# EAGLE design EMGrealPart6-doc (EAGLE 9.4.0)

## Sheet 1 of 6
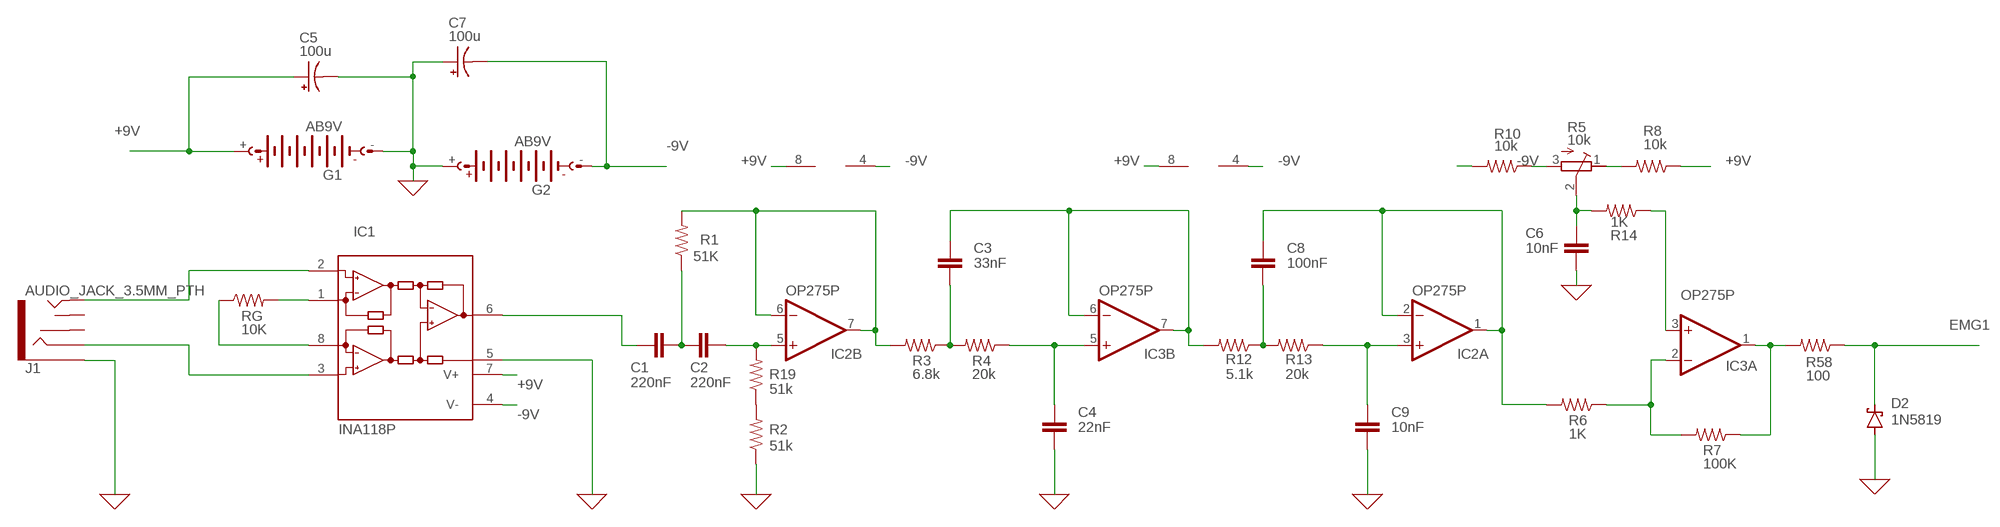
[diagram p0: schematic, sheet 1]

### Parts
C1  220nF  C-EU050-025X075  [C050-025X075]
C2  220nF  C-EU050-025X075  [C050-025X075]
C3  33nF  C-EU050-025X075  [C050-025X075]
C4  22nF  C-EU050-025X075  [C050-025X075]
C5  100u  CPOL-USE2.5-6  [E2,5-6]
C6  10nF  C-EU050-025X075  [C050-025X075]
C7  100u  CPOL-USE2.5-6  [E2,5-6]
C8  100nF  C-EU050-025X075  [C050-025X075]
C9  10nF  C-EU050-025X075  [C050-025X075]
D2  1N5819  SCHOTTKY-DIODEF126Z12  [F126Z12]
G1  AB9V  [AB9V]
G2  AB9V  [AB9V]
IC1  INA118P  [DIL08]
IC2  OP275P  [DIL08]
IC3  OP275P  [DIL08]
J1  AUDIO_JACK_3.5MM_PTH  [AUDIO-JACK]
R1  51K  R-US_0207/12  [0207/12]
R2  51k  R-US_0207/12  [0207/12]
R3  6.8k  R-US_0207/12  [0207/12]
R4  20k  R-US_0207/12  [0207/12]
R5  10k  R-TRIMMT93YA  [RTRIMT93YA]
R6  1K  R-US_0207/12  [0207/12]
R7  100K  R-US_0207/12  [0207/12]
R8  10k  R-US_0207/12  [0207/12]
R10  10k  R-US_0207/12  [0207/12]
R12  5.1k  R-US_0207/12  [0207/12]
R13  20k  R-US_0207/12  [0207/12]
R14  1K  R-US_0207/12  [0207/12]
R19  51k  R-US_0207/12  [0207/12]
R58  100  R-US_0207/12  [0207/12]
RG  10K  R-US_0207/12  [0207/12]

### Nets
0 [supply]: C4.2 C6.2 C9.2 D2.A IC1.5(REF) J1.SLEEVE R2.1 ; supply symbol labelled GND ; also sheet 2,3,4,5
+9V [supply]: C5.+ G1.+ IC1.7(V+) IC2.8(P:V+) IC3.8(P:V+) R8.1 ; also sheet 2,3,4
-9V [supply]: C7.- G2.- IC1.4(V-) IC2.4(P:V-) IC3.4(P:V-) R10.2 ; also sheet 2,3,4
EMG1 [signal]: D2.C R58.1 ; also sheet 5
N$1 [signal]: IC1.1(RG) RG.2
N$2 [signal]: IC1.8(RG) RG.1
N$3 [signal]: IC1.2(-IN) J1.TIP
N$4 [signal]: C8.2 R12.1 R13.2
N$5 [signal]: C1.2 C2.1 R1.1
N$6 [signal]: C1.1 IC1.6(OUT)
N$7 [signal]: C2.2 IC2.5(B:+IN) R19.2
N$8 [signal]: IC2.6(B:-IN) IC2.7(B:OUT) R1.2 R3.2
N$9 [signal]: C3.2 R3.1 R4.2
N$10 [signal]: C4.1 IC3.5(B:+IN) R4.1
N$11 [signal]: C3.1 IC3.6(B:-IN) IC3.7(B:OUT) R12.2
N$14 [signal]: C9.1 IC2.3(A:+IN) R13.1
N$15 [signal]: R5.3(A) R10.1
N$16 [signal]: C6.1 R5.2(S) R14.2
N$17 [signal]: IC3.2(A:-IN) R6.1 R7.2
N$18 [signal]: R2.2 R19.1
N$19 [signal]: C8.1 IC2.1(A:OUT) IC2.2(A:-IN) R6.2
N$20 [signal]: R5.1(E) R8.2
N$25 [signal]: IC3.3(A:+IN) R14.1
N$26 [signal]: IC1.3(+IN) J1.RING
N$107: IC3.1(A:OUT) R7.1 R58.2
N$143 [supply]: C5.- C7.+ G1.- G2.+ ; supply symbol labelled GND
Unconnected: J1.RSH J1.TSH

## Sheet 2 of 6
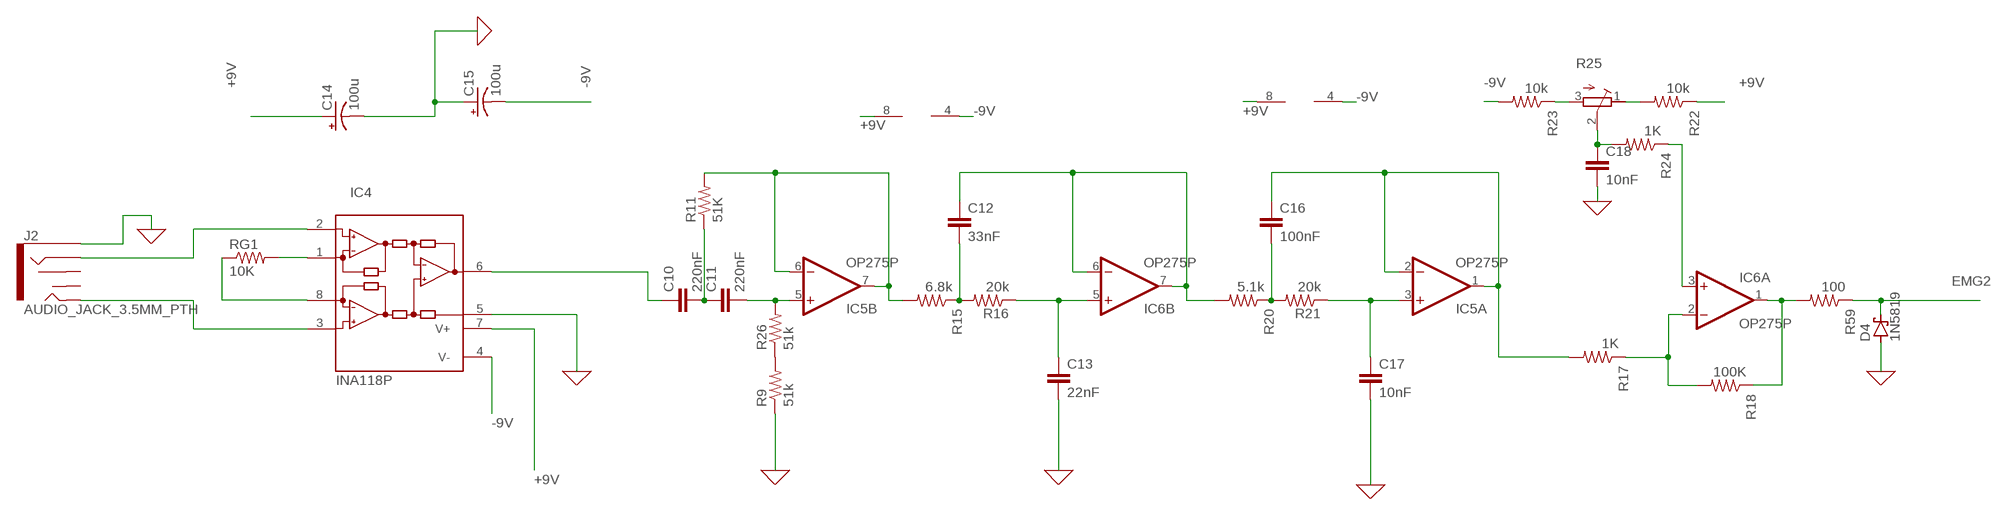
[diagram p1: schematic, sheet 2]

### Parts
C10  220nF  C-EU050-025X075  [C050-025X075]
C11  220nF  C-EU050-025X075  [C050-025X075]
C12  33nF  C-EU050-025X075  [C050-025X075]
C13  22nF  C-EU050-025X075  [C050-025X075]
C14  100u  CPOL-USE2.5-6  [E2,5-6]
C15  100u  CPOL-USE2.5-6  [E2,5-6]
C16  100nF  C-EU050-025X075  [C050-025X075]
C17  10nF  C-EU050-025X075  [C050-025X075]
C18  10nF  C-EU050-025X075  [C050-025X075]
D4  1N5819  SCHOTTKY-DIODEF126Z12  [F126Z12]
IC4  INA118P  [DIL08]
IC5  OP275P  [DIL08]
IC6  OP275P  [DIL08]
J2  AUDIO_JACK_3.5MM_PTH  [AUDIO-JACK]
R9  51k  R-US_0207/12  [0207/12]
R11  51K  R-US_0207/12  [0207/12]
R15  6.8k  R-US_0207/12  [0207/12]
R16  20k  R-US_0207/12  [0207/12]
R17  1K  R-US_0207/12  [0207/12]
R18  100K  R-US_0207/12  [0207/12]
R20  5.1k  R-US_0207/12  [0207/12]
R21  20k  R-US_0207/12  [0207/12]
R22  10k  R-US_0207/12  [0207/12]
R23  10k  R-US_0207/12  [0207/12]
R24  1K  R-US_0207/12  [0207/12]
R25  R-TRIMMT93YA  [RTRIMT93YA]
R26  51k  R-US_0207/12  [0207/12]
R59  100  R-US_0207/12  [0207/12]
RG1  10K  R-US_0207/12  [0207/12]

### Nets
0 [supply]: C13.2 C14.- C15.+ C17.2 C18.2 D4.A IC4.5(REF) J2.SLEEVE R9.1 ; supply symbol labelled GND ; also sheet 1,3,4,5
+9V [supply]: C14.+ IC4.7(V+) IC5.8(P:V+) IC6.8(P:V+) R22.1 ; also sheet 1,3,4
-9V [supply]: C15.- IC4.4(V-) IC5.4(P:V-) IC6.4(P:V-) R23.2 ; also sheet 1,3,4
EMG2 [signal]: D4.C R59.1 ; also sheet 5
N$21 [signal]: IC4.1(RG) RG1.2
N$22 [signal]: IC4.8(RG) RG1.1
N$23 [signal]: C10.1 IC4.6(OUT)
N$24 [signal]: C10.2 C11.1 R11.1
N$27 [signal]: C11.2 IC5.5(B:+IN) R26.2
N$28 [signal]: IC5.6(B:-IN) IC5.7(B:OUT) R11.2 R15.2
N$29 [signal]: C12.2 R15.1 R16.2
N$30 [signal]: C13.1 IC6.5(B:+IN) R16.1
N$31 [signal]: C12.1 IC6.6(B:-IN) IC6.7(B:OUT) R20.2
N$32 [signal]: IC6.2(A:-IN) R17.1 R18.2
N$33: IC6.1(A:OUT) R18.1 R59.2
N$34 [signal]: C16.2 R20.1 R21.2
N$35 [signal]: C17.1 IC5.3(A:+IN) R21.1
N$36 [signal]: IC4.2(-IN) J2.RING
N$37 [signal]: C16.1 IC5.1(A:OUT) IC5.2(A:-IN) R17.2
N$38 [signal]: IC4.3(+IN) J2.TIP
N$39 [signal]: R23.1 R25.3(A)
N$40 [signal]: R22.2 R25.1(E)
N$41 [signal]: IC6.3(A:+IN) R24.1
N$42 [signal]: C18.1 R24.2 R25.2(S)
N$43 [signal]: R9.2 R26.1
Unconnected: J2.RSH J2.TSH

## Sheet 3 of 6
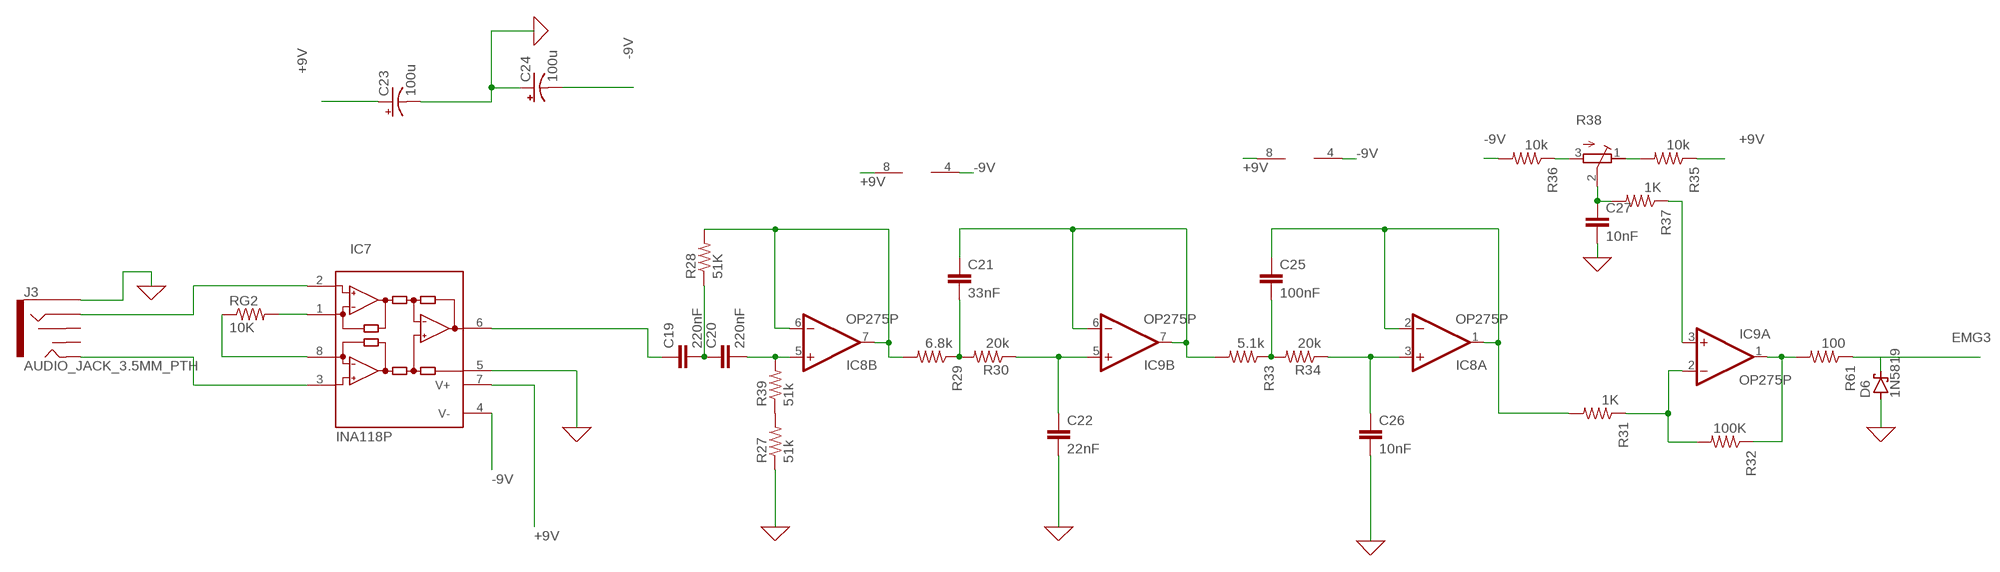
[diagram p2: schematic, sheet 3]

### Parts
C19  220nF  C-EU050-025X075  [C050-025X075]
C20  220nF  C-EU050-025X075  [C050-025X075]
C21  33nF  C-EU050-025X075  [C050-025X075]
C22  22nF  C-EU050-025X075  [C050-025X075]
C23  100u  CPOL-USE2.5-6  [E2,5-6]
C24  100u  CPOL-USE2.5-6  [E2,5-6]
C25  100nF  C-EU050-025X075  [C050-025X075]
C26  10nF  C-EU050-025X075  [C050-025X075]
C27  10nF  C-EU050-025X075  [C050-025X075]
D6  1N5819  SCHOTTKY-DIODEF126Z12  [F126Z12]
IC7  INA118P  [DIL08]
IC8  OP275P  [DIL08]
IC9  OP275P  [DIL08]
J3  AUDIO_JACK_3.5MM_PTH  [AUDIO-JACK]
R27  51k  R-US_0207/12  [0207/12]
R28  51K  R-US_0207/12  [0207/12]
R29  6.8k  R-US_0207/12  [0207/12]
R30  20k  R-US_0207/12  [0207/12]
R31  1K  R-US_0207/12  [0207/12]
R32  100K  R-US_0207/12  [0207/12]
R33  5.1k  R-US_0207/12  [0207/12]
R34  20k  R-US_0207/12  [0207/12]
R35  10k  R-US_0207/12  [0207/12]
R36  10k  R-US_0207/12  [0207/12]
R37  1K  R-US_0207/12  [0207/12]
R38  R-TRIMMT93YA  [RTRIMT93YA]
R39  51k  R-US_0207/12  [0207/12]
R61  100  R-US_0207/12  [0207/12]
RG2  10K  R-US_0207/12  [0207/12]

### Nets
0 [supply]: C22.2 C23.- C24.+ C26.2 C27.2 D6.A IC7.5(REF) J3.SLEEVE R27.1 ; supply symbol labelled GND ; also sheet 1,2,4,5
+9V [supply]: C23.+ IC7.7(V+) IC8.8(P:V+) IC9.8(P:V+) R35.1 ; also sheet 1,2,4
-9V [supply]: C24.- IC7.4(V-) IC8.4(P:V-) IC9.4(P:V-) R36.2 ; also sheet 1,2,4
EMG3 [signal]: D6.C R61.1 ; also sheet 5
N$44 [signal]: IC7.1(RG) RG2.2
N$45 [signal]: IC7.8(RG) RG2.1
N$46 [signal]: C19.1 IC7.6(OUT)
N$47 [signal]: C19.2 C20.1 R28.1
N$48 [signal]: C20.2 IC8.5(B:+IN) R39.2
N$49 [signal]: IC8.6(B:-IN) IC8.7(B:OUT) R28.2 R29.2
N$50 [signal]: C21.2 R29.1 R30.2
N$51 [signal]: C22.1 IC9.5(B:+IN) R30.1
N$52 [signal]: C21.1 IC9.6(B:-IN) IC9.7(B:OUT) R33.2
N$53 [signal]: IC9.2(A:-IN) R31.1 R32.2
N$54: IC9.1(A:OUT) R32.1 R61.2
N$55 [signal]: C25.2 R33.1 R34.2
N$56 [signal]: C26.1 IC8.3(A:+IN) R34.1
N$57 [signal]: IC7.2(-IN) J3.RING
N$58 [signal]: C25.1 IC8.1(A:OUT) IC8.2(A:-IN) R31.2
N$59 [signal]: IC7.3(+IN) J3.TIP
N$60 [signal]: R36.1 R38.3(A)
N$61 [signal]: R35.2 R38.1(E)
N$62 [signal]: IC9.3(A:+IN) R37.1
N$63 [signal]: C27.1 R37.2 R38.2(S)
N$64 [signal]: R27.2 R39.1
Unconnected: J3.RSH J3.TSH

## Sheet 4 of 6
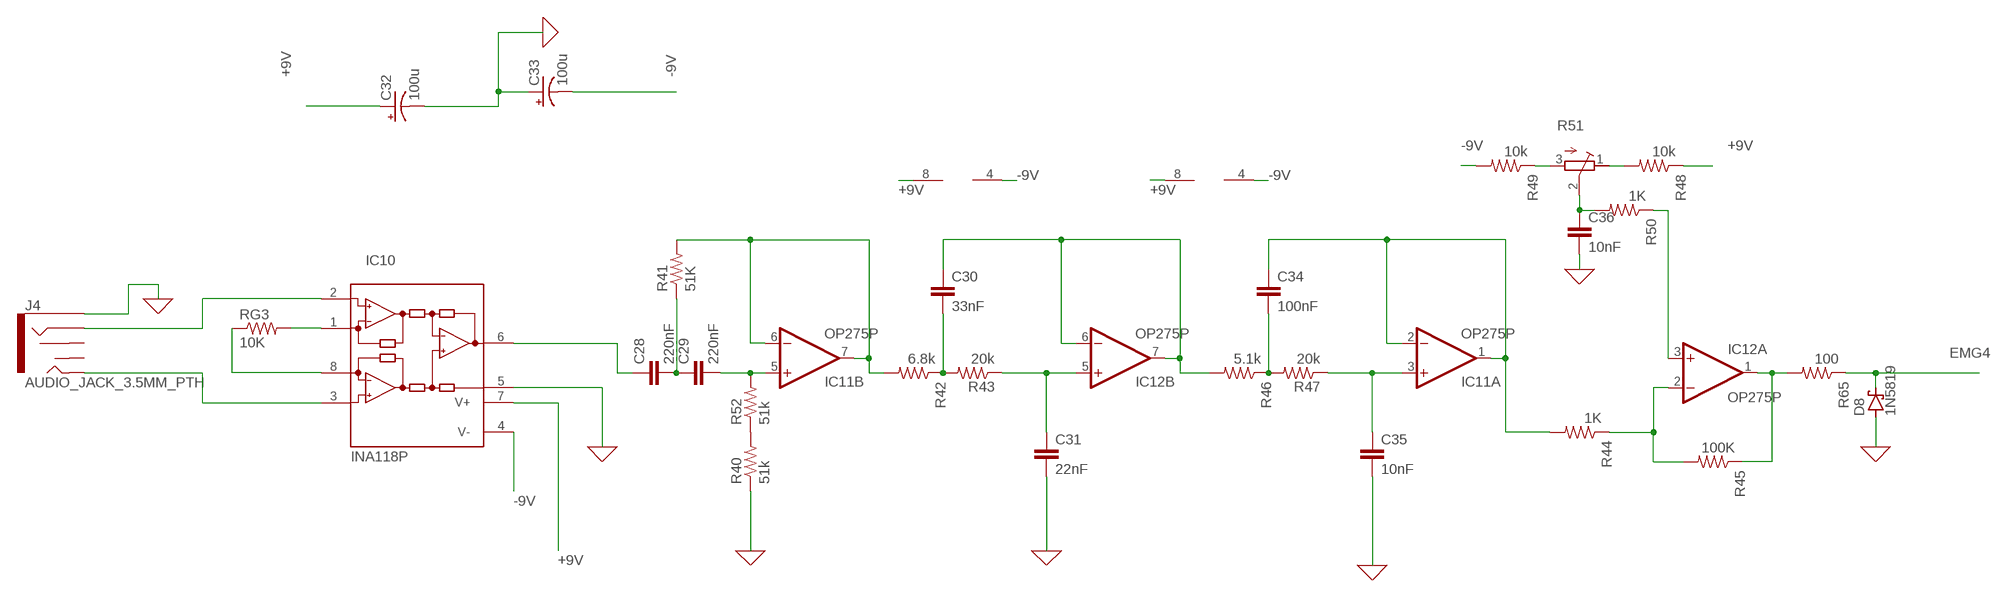
[diagram p3: schematic, sheet 4]

### Parts
C28  220nF  C-EU050-025X075  [C050-025X075]
C29  220nF  C-EU050-025X075  [C050-025X075]
C30  33nF  C-EU050-025X075  [C050-025X075]
C31  22nF  C-EU050-025X075  [C050-025X075]
C32  100u  CPOL-USE2.5-6  [E2,5-6]
C33  100u  CPOL-USE2.5-6  [E2,5-6]
C34  100nF  C-EU050-025X075  [C050-025X075]
C35  10nF  C-EU050-025X075  [C050-025X075]
C36  10nF  C-EU050-025X075  [C050-025X075]
D8  1N5819  SCHOTTKY-DIODEF126Z12  [F126Z12]
IC10  INA118P  [DIL08]
IC11  OP275P  [DIL08]
IC12  OP275P  [DIL08]
J4  AUDIO_JACK_3.5MM_PTH  [AUDIO-JACK]
R40  51k  R-US_0207/12  [0207/12]
R41  51K  R-US_0207/12  [0207/12]
R42  6.8k  R-US_0207/12  [0207/12]
R43  20k  R-US_0207/12  [0207/12]
R44  1K  R-US_0207/12  [0207/12]
R45  100K  R-US_0207/12  [0207/12]
R46  5.1k  R-US_0207/12  [0207/12]
R47  20k  R-US_0207/12  [0207/12]
R48  10k  R-US_0207/12  [0207/12]
R49  10k  R-US_0207/12  [0207/12]
R50  1K  R-US_0207/12  [0207/12]
R51  R-TRIMMT93YA  [RTRIMT93YA]
R52  51k  R-US_0207/12  [0207/12]
R65  100  R-US_0207/12  [0207/12]
RG3  10K  R-US_0207/12  [0207/12]

### Nets
0 [supply]: C31.2 C32.- C33.+ C35.2 C36.2 D8.A IC10.5(REF) J4.SLEEVE R40.1 ; supply symbol labelled GND ; also sheet 1,2,3,5
+9V [supply]: C32.+ IC10.7(V+) IC11.8(P:V+) IC12.8(P:V+) R48.1 ; also sheet 1,2,3
-9V [supply]: C33.- IC10.4(V-) IC11.4(P:V-) IC12.4(P:V-) R49.2 ; also sheet 1,2,3
EMG4 [signal]: D8.C R65.1 ; also sheet 5
N$65 [signal]: IC10.1(RG) RG3.2
N$66 [signal]: IC10.8(RG) RG3.1
N$67 [signal]: C28.1 IC10.6(OUT)
N$68 [signal]: C28.2 C29.1 R41.1
N$69 [signal]: C29.2 IC11.5(B:+IN) R52.2
N$70 [signal]: IC11.6(B:-IN) IC11.7(B:OUT) R41.2 R42.2
N$71 [signal]: C30.2 R42.1 R43.2
N$72 [signal]: C31.1 IC12.5(B:+IN) R43.1
N$73 [signal]: C30.1 IC12.6(B:-IN) IC12.7(B:OUT) R46.2
N$74 [signal]: IC12.2(A:-IN) R44.1 R45.2
N$75: IC12.1(A:OUT) R45.1 R65.2
N$76 [signal]: C34.2 R46.1 R47.2
N$77 [signal]: C35.1 IC11.3(A:+IN) R47.1
N$78 [signal]: IC10.2(-IN) J4.RING
N$79 [signal]: C34.1 IC11.1(A:OUT) IC11.2(A:-IN) R44.2
N$80 [signal]: IC10.3(+IN) J4.TIP
N$81 [signal]: R49.1 R51.3(A)
N$82 [signal]: R48.2 R51.1(E)
N$83 [signal]: IC12.3(A:+IN) R50.1
N$84 [signal]: C36.1 R50.2 R51.2(S)
N$85 [signal]: R40.2 R52.1
Unconnected: J4.RSH J4.TSH

## Sheet 5 of 6
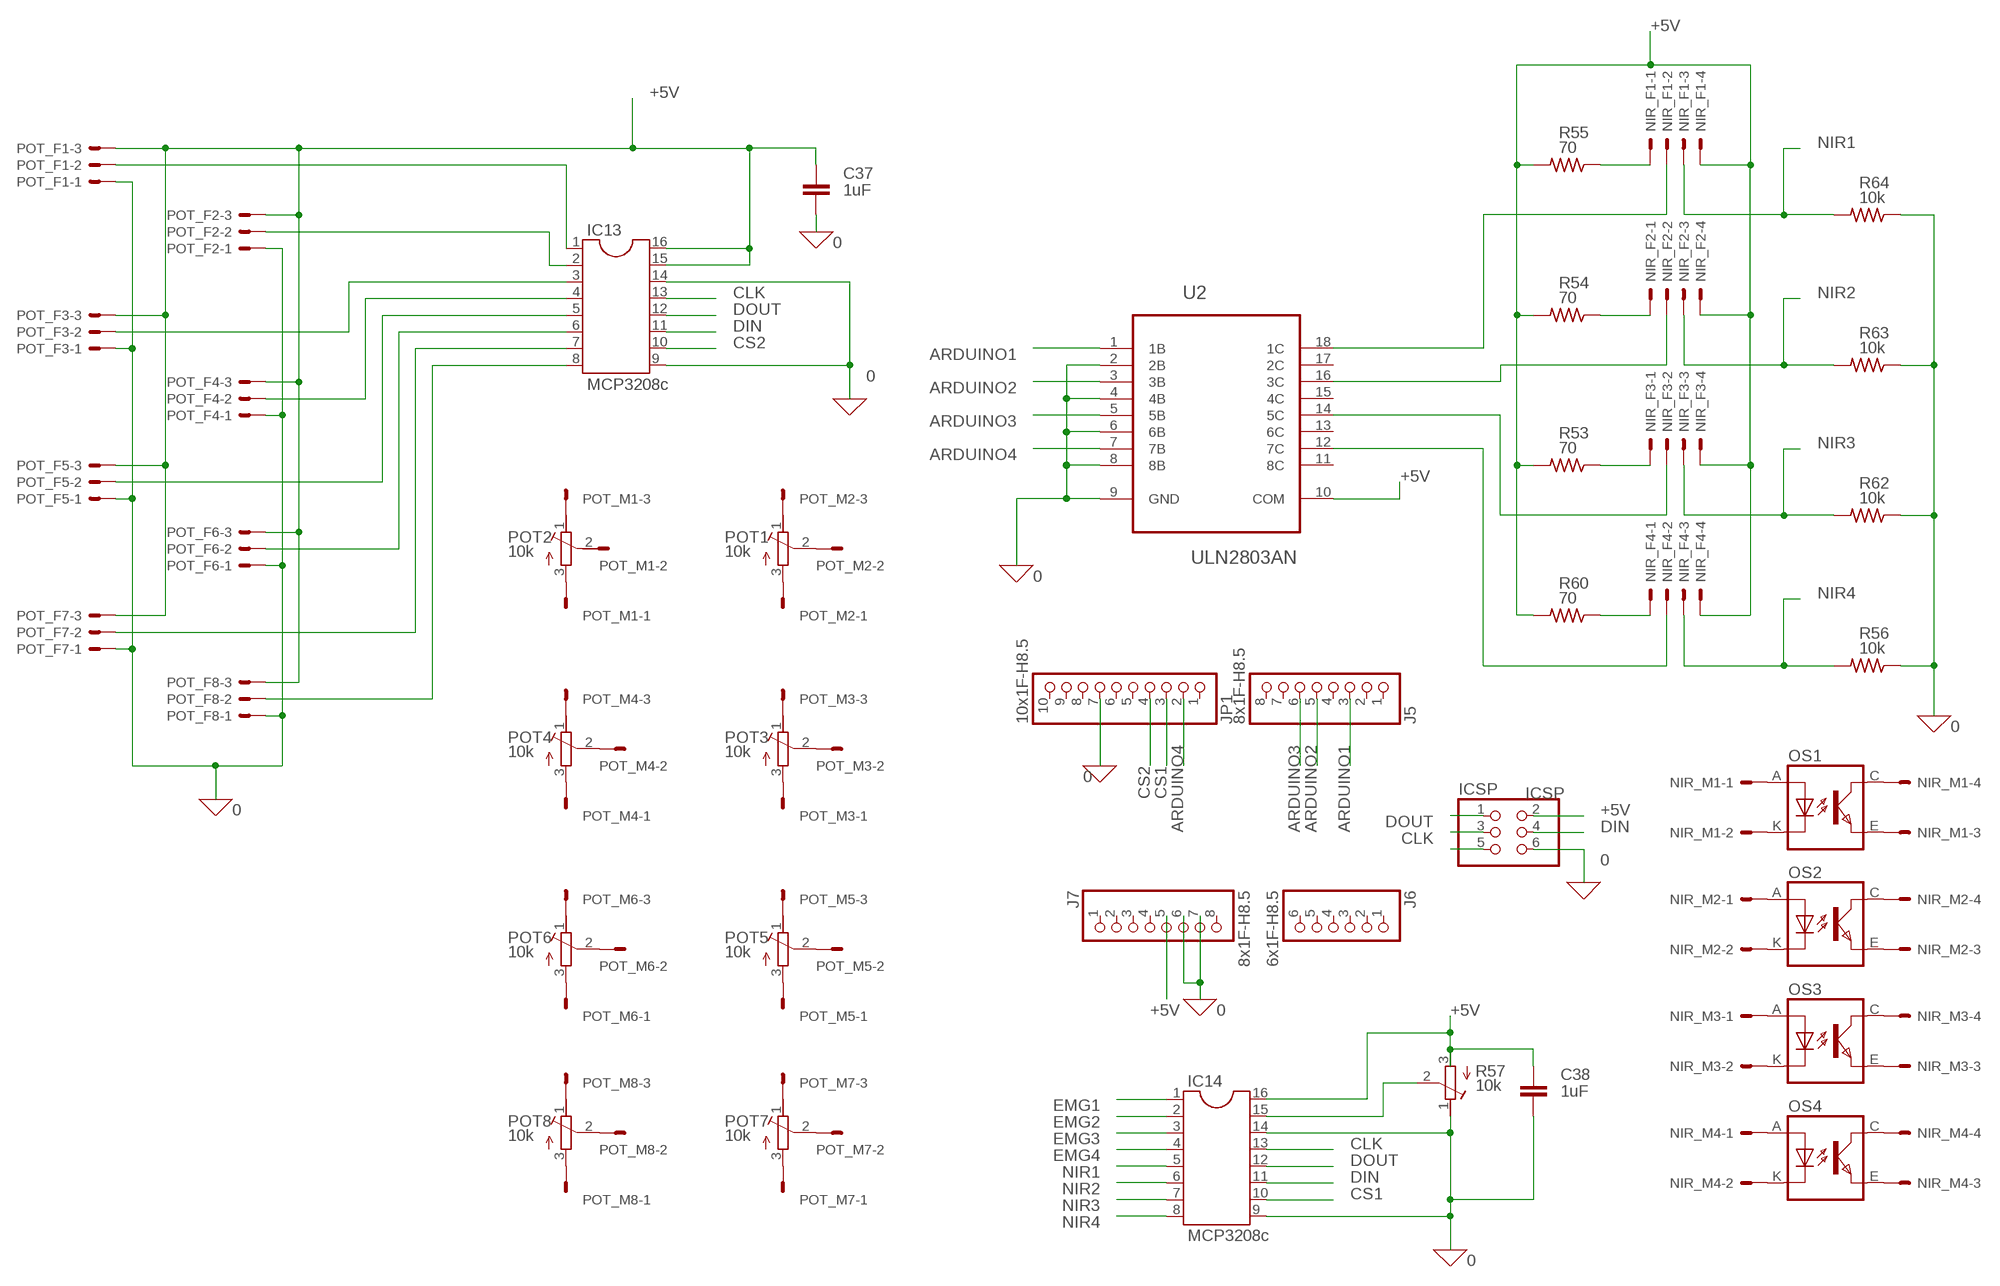
[diagram p4: schematic, sheet 5]

### Parts
C37  1uF  C-EU050-025X075  [C050-025X075]
C38  1uF  C-EU050-025X075  [C050-025X075]
IC13  MCP3208c  DIL16  [DIL16]
IC14  MCP3208c  DIL16  [DIL16]
ICSP  ICSP  PINHD-2X3  [2X03]
J5  8x1F-H8.5  PINHD-1X8  [1X08]
J6  6x1F-H8.5  PINHD-1X6  [1X06]
J7  8x1F-H8.5  PINHD-1X8  [1X08]
JP1  10x1F-H8.5  PINHD-1X10  [1X10]
NIR_F1  22-23-2041  [22-23-2041]
NIR_F2  22-23-2041  [22-23-2041]
NIR_F3  22-23-2041  [22-23-2041]
NIR_F4  22-23-2041  [22-23-2041]
NIR_M1  22-23-2041  [22-23-2041]
NIR_M2  22-23-2041  [22-23-2041]
NIR_M3  22-23-2041  [22-23-2041]
NIR_M4  22-23-2041  [22-23-2041]
OS1  TCRT5000  [TCRT5000]
OS2  TCRT5000  [TCRT5000]
OS3  TCRT5000  [TCRT5000]
OS4  TCRT5000  [TCRT5000]
POT1  10k  R-TRIMMT93YA  [RTRIMT93YA]
POT2  10k  R-TRIMMT93YA  [RTRIMT93YA]
POT3  10k  R-TRIMMT93YA  [RTRIMT93YA]
POT4  10k  R-TRIMMT93YA  [RTRIMT93YA]
POT5  10k  R-TRIMMT93YA  [RTRIMT93YA]
POT6  10k  R-TRIMMT93YA  [RTRIMT93YA]
POT7  10k  R-TRIMMT93YA  [RTRIMT93YA]
POT8  10k  R-TRIMMT93YA  [RTRIMT93YA]
POT_F1  22-23-2031  [22-23-2031]
POT_F2  22-23-2031  [22-23-2031]
POT_F3  22-23-2031  [22-23-2031]
POT_F4  22-23-2031  [22-23-2031]
POT_F5  22-23-2031  [22-23-2031]
POT_F6  22-23-2031  [22-23-2031]
POT_F7  22-23-2031  [22-23-2031]
POT_F8  22-23-2031  [22-23-2031]
POT_M1  22-23-2031  [22-23-2031]
POT_M2  22-23-2031  [22-23-2031]
POT_M3  22-23-2031  [22-23-2031]
POT_M4  22-23-2031  [22-23-2031]
POT_M5  22-23-2031  [22-23-2031]
POT_M6  22-23-2031  [22-23-2031]
POT_M7  22-23-2031  [22-23-2031]
POT_M8  22-23-2031  [22-23-2031]
R53  70  R-US_0207/12  [0207/12]
R54  70  R-US_0207/12  [0207/12]
R55  70  R-US_0207/12  [0207/12]
R56  10k  R-US_0207/12  [0207/12]
R57  10k  R-TRIMMT93YA  [RTRIMT93YA]
R60  70  R-US_0207/12  [0207/12]
R62  10k  R-US_0207/12  [0207/12]
R63  10k  R-US_0207/12  [0207/12]
R64  10k  R-US_0207/12  [0207/12]
U2  ULN2803AN  [DIP254P762X393-18]

### Nets
0 [supply]: C37.1 C38.1 IC13.9 IC13.14 IC14.9 IC14.14 ICSP.6 J7.6 J7.7 JP1.7 POT_F1.1 POT_F2.1 POT_F3.1 POT_F4.1 POT_F5.1 POT_F6.1 POT_F7.1 POT_F8.1 R56.1 R57.1(E) R62.1 R63.1 R64.1 U2.2(2B) U2.4(4B) U2.6(6B) U2.8(8B) U2.9(GND) ; supply symbol labelled GND ; also sheet 1,2,3,4
+5V [supply]: C37.2 C38.2 IC13.15 IC13.16 IC14.16 ICSP.2 J7.5 NIR_F1.4 NIR_F2.4 NIR_F3.4 NIR_F4.4 POT_F1.3 POT_F2.3 POT_F3.3 POT_F4.3 POT_F5.3 POT_F6.3 POT_F7.3 POT_F8.3 R53.2 R54.2 R55.2 R57.3(A) R60.2 U2.10(COM)
ARDUINO1 [signal]: J5.3 U2.1(1B)
ARDUINO2 [signal]: J5.5 U2.3(3B)
ARDUINO3 [signal]: J5.6 U2.5(5B)
ARDUINO4 [signal]: JP1.2 U2.7(7B)
CLK [signal]: IC13.13 IC14.13 ICSP.3
CS1 [signal]: IC14.10 JP1.3
CS2 [signal]: IC13.10 JP1.4
DIN [signal]: IC13.11 IC14.11 ICSP.4
DOUT [signal]: IC13.12 IC14.12 ICSP.1
EMG1 [signal]: IC14.1 ; also sheet 1
EMG2 [signal]: IC14.2 ; also sheet 2
EMG3 [signal]: IC14.3 ; also sheet 3
EMG4 [signal]: IC14.4 ; also sheet 4
N$12 [signal]: NIR_F1.2 U2.18(1C)
N$13: NIR_M1.1 OS1.A(ANODE)
N$86 [signal]: NIR_F2.2 U2.16(3C)
N$87 [signal]: NIR_F3.2 U2.14(5C)
N$88 [signal]: NIR_F4.2 U2.12(7C)
N$89 [signal]: IC13.1 POT_F1.2
N$90 [signal]: IC13.2 POT_F2.2
N$91 [signal]: IC13.3 POT_F3.2
N$92 [signal]: IC13.4 POT_F4.2
N$93 [signal]: IC13.5 POT_F5.2
N$94 [signal]: IC13.6 POT_F6.2
N$95 [signal]: IC13.7 POT_F7.2
N$96 [signal]: IC13.8 POT_F8.2
N$97 [signal]: IC14.15 R57.2(S)
N$98 [signal]: NIR_F1.1 R55.1
N$99 [signal]: NIR_F2.1 R54.1
N$100 [signal]: NIR_F3.1 R53.1
N$101 [signal]: NIR_F4.1 R60.1
N$102: ICSP.5
N$103: NIR_M1.2 OS1.K(CATHODE)
N$104: NIR_M1.3 OS1.E(EMITTER)
N$106: NIR_M1.4 OS1.C(COLLECTOR)
N$108: NIR_M2.1 OS2.A(ANODE)
N$109: NIR_M2.2 OS2.K(CATHODE)
N$110: NIR_M2.3 OS2.E(EMITTER)
N$111: NIR_M2.4 OS2.C(COLLECTOR)
N$112: NIR_M3.1 OS3.A(ANODE)
N$113: NIR_M3.2 OS3.K(CATHODE)
N$114: NIR_M3.3 OS3.E(EMITTER)
N$115: NIR_M3.4 OS3.C(COLLECTOR)
N$116: NIR_M4.1 OS4.A(ANODE)
N$117: NIR_M4.2 OS4.K(CATHODE)
N$118: NIR_M4.3 OS4.E(EMITTER)
N$119: NIR_M4.4 OS4.C(COLLECTOR)
N$120: POT2.1(E) POT_M1.3
N$121: POT2.3(A) POT_M1.1
N$122: POT1.1(E) POT_M2.3
N$123: POT1.3(A) POT_M2.1
N$124: POT1.2(S) POT_M2.2
N$125: POT4.1(E) POT_M4.3
N$126: POT4.3(A) POT_M4.1
N$127: POT4.2(S) POT_M4.2
N$128: POT3.1(E) POT_M3.3
N$129: POT3.3(A) POT_M3.1
N$130: POT3.2(S) POT_M3.2
N$131: POT6.1(E) POT_M6.3
N$132: POT6.2(S) POT_M6.2
N$133: POT6.3(A) POT_M6.1
N$134: POT5.3(A) POT_M5.1
N$135: POT5.2(S) POT_M5.2
N$136: POT5.1(E) POT_M5.3
N$137: POT8.1(E) POT_M8.3
N$138: POT8.3(A) POT_M8.1
N$139: POT8.2(S) POT_M8.2
N$140: POT7.3(A) POT_M7.1
N$141: POT7.1(E) POT_M7.3
N$142: POT7.2(S) POT_M7.2
NIR1 [signal]: IC14.5 NIR_F1.3 R64.2
NIR2 [signal]: IC14.6 NIR_F2.3 R63.2
NIR3 [signal]: IC14.7 NIR_F3.3 R62.2
NIR4 [signal]: IC14.8 NIR_F4.3 R56.2
Unconnected: J5.1 J5.2 J5.4 J5.7 J5.8 J6.1 J6.2 J6.3 J6.4 J6.5 J6.6 J7.1 J7.2 J7.3 J7.4 J7.8 JP1.1 JP1.5 JP1.6 JP1.8 JP1.9 JP1.10 POT2.2(S) POT_M1.2 U2.11(8C) U2.13(6C) U2.15(4C) U2.17(2C)

## Sheet 6 of 6

## Library data of the parts
C1-C4 C6 C8-C13 C16-C22 C25-C31 C34-C38 = rcl:C-EU: CAPACITOR, European symbol; SPICEPREFIX: C
C5 C7 C14 C15 C23 C24 C32 C33 = rcl:CPOL-US: POLARIZED CAPACITOR, American symbol; SPICEPREFIX: C
D2 D4 D6 D8 = diode:SCHOTTKY-DIODE: Schottky Diode
G1 G2 = battery:AB9V: 9-V BATTERY CLIP
IC1 IC4 IC7 IC10 = burr-brown:INA118: Instrumentation Amplifier Precision, Low Power; MF: TEXAS INSTRUMENTS; MPN: INA118P; OC_FARNELL: 1470354; OC_NEWARK: 96K4515; SPICEMODEL: INA118a; SPICEPREFIX: X
IC2 IC3 IC5 IC6 IC8 IC9 IC11 IC12 = linear:OP275: Dual Very Low Noise Precision Operational Amplifier Source: http://www.analog.com/static/imported-files/data_sheets/OP270.pdf; SPICEMODEL: OP275p; SPICEPREFIX: X
IC13 IC14 = ic-package:DIL16: Dual In Line / Socket
ICSP = SmartPrj:PINHD-2X3: PIN HEADER
J1-J4 = SparkFun-Connectors:AUDIO_JACK_3.5MM: Audio Jack 3.5mm variants of PTH and SMT stereo audio jack with bypass switches. SparkFun Products: SparkFun SparkPunk Sound Kit <[https://www.sparkfun.com/products/11177]> - PTH MP3 Trigger <https://www.sparkfun.com/products/13720> -3.5mm SMD SparkFun PicoBoard <https://www.sparkfun.com/products/11888>- 2.5mm SMD; PROD_ID: CONN-08774; SF_ID: PRT-08032
J5 J7 = SmartPrj:PINHD-1X8: PIN HEADER
J6 = SmartPrj:PINHD-1X6: PIN HEADER
JP1 = SmartPrj:PINHD-1X10: PIN HEADER
NIR_F1-NIR_F4 NIR_M1-NIR_M4 = con-molex:22-23-2041: .100" (2.54mm) Center Header - 4 Pin; MF: MOLEX; MPN: 22-23-2041; OC_FARNELL: 1462920; OC_NEWARK: 38C0355
OS1-OS4 = tcrt5000:TCRT5000
POT1-POT8 R5 R25 R38 R51 R57 = rcl:R-TRIMM: Trimm resistor; SPICEMODEL: X; SPICEPREFIXL: POT
POT_F1-POT_F8 POT_M1-POT_M8 = con-molex:22-23-2031: .100" (2.54mm) Center Header - 3 Pin; MF: MOLEX; MPN: 22-23-2031; OC_FARNELL: 1462950; OC_NEWARK: 30C0862
R1-R4 R6-R24 R26-R37 R39-R50 R52-R56 R58-R65 RG RG1-RG3 = rcl:R-US_: RESISTOR, American symbol; SPICEPREFIX: R
U2 = transistor-arrays:ULN2803AN: Darlington transistor array; MPN: ULN2803AN; OC_FARNELL: 1652422; OC_NEWARK: 21J9298; PACKAGE: DIP-18; SUPPLIER: TEXAS INSTRUMENTS

## Module MO
Ports: OUT(io) IN(io)

### Library data of the parts

## Net classes
1 signal: width 0.305 mm
2 supply: width 0.635 mm

## Board
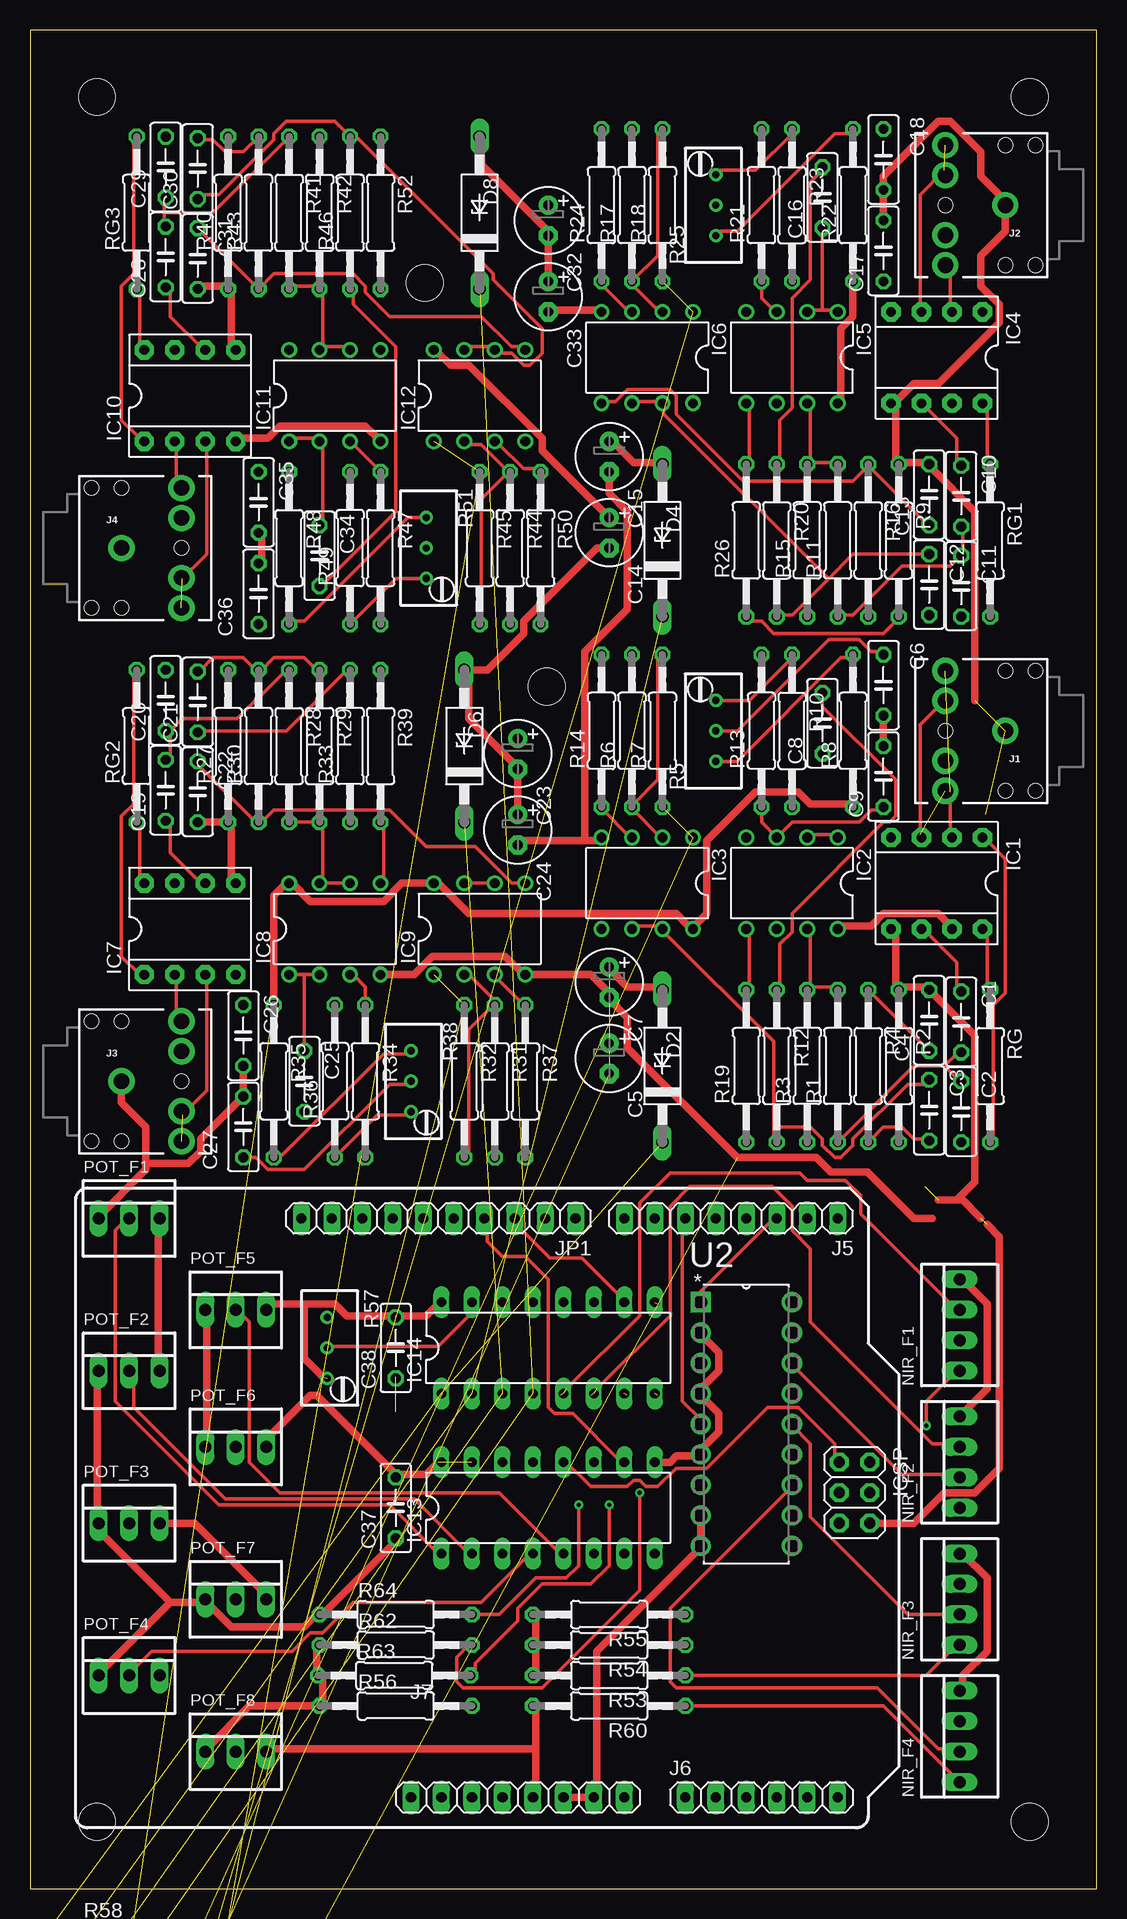
[diagram p5: board, top side]
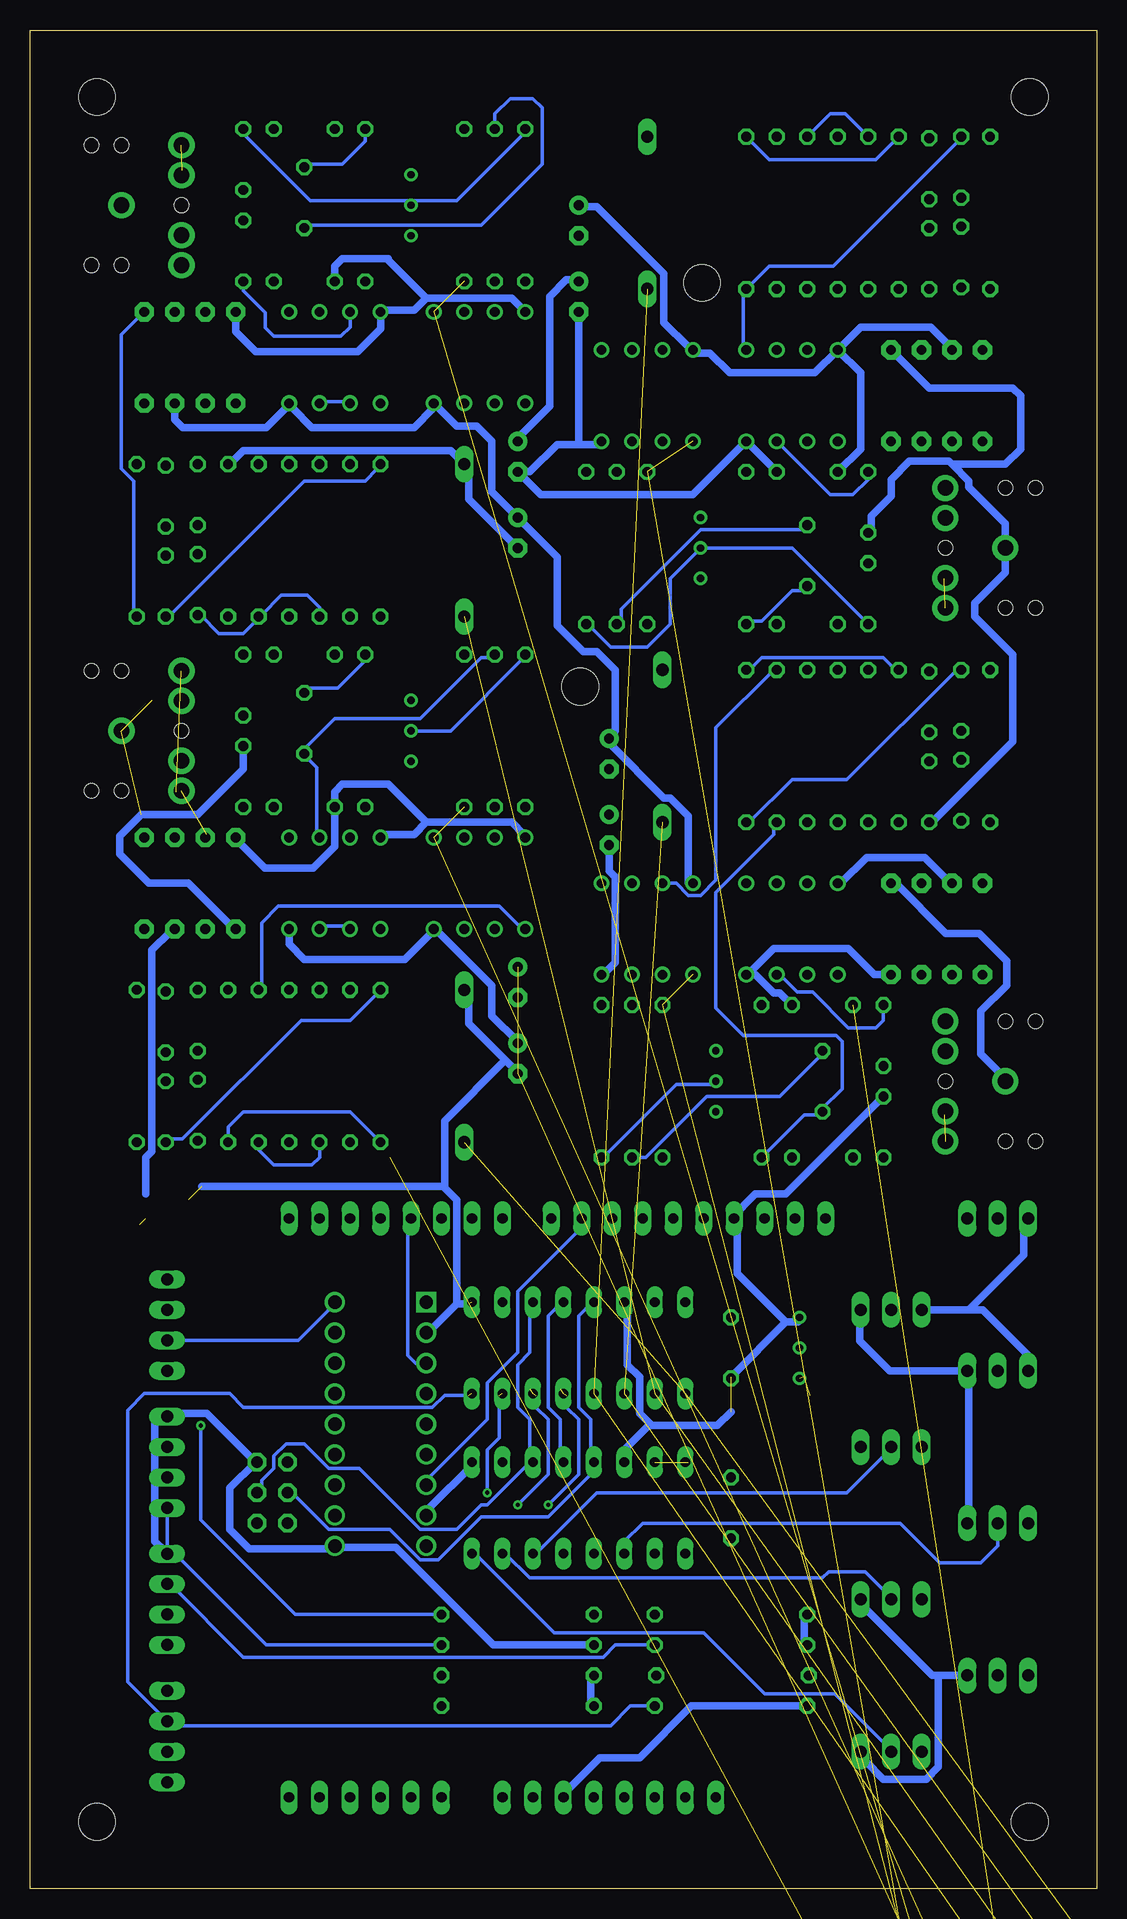
[diagram p6: board, bottom side, seen from below]

Size 88.9 x 154.94 mm. Coordinates in mm from the lower left corner, seen from the top.
Outline: 0,0 88.9,0 88.9,154.94 0,154.94 0,0
Copper layers (1*16): Top 0.035mm / dielectric 1.5mm / Bottom 0.035mm
Design rules "default": minimum track width 6mil, minimum drill 0.35mm, track to track 6mil, track to pad 6mil, pad to pad 6mil, via to via 6mil, smd to smd 6mil, copper to edge 40mil, drill to drill 6mil, minimum pad ring 10mil, minimum via ring 8mil, stop-mask expansion 4mil, vias tented up to drill 0mil, thermal gap 10mil
Holes 3.05 mm at 5.59,5.59 83.31,149.35 5.59,149.35 83.31,5.59 43.05,100.2 32.89,133.86
tKeepout: 4 lines

### Footprints (pad centres in the part's own frame; a part is rotated, then mirrored left to right if it is on the bottom)
C050-025X075 = drill 0.813 octagon: 1 -2.54,0; 2 2.54,0
E2,5-6 = drill 0.813 pad 1.6: + -1.27,0 | drill 0.813 pad 1.6 octagon: - 1.27,0
F126Z12 = drill 1.016 long: A 6.35,0; C -6.35,0
AB9V = drill 1.118 pad 3.15 octagon: + 0,2.54; - 0,-2.54
DIL08 = drill 0.813 pad 1.6 octagon: 1 -3.81,-3.81; 2 -1.27,-3.81; 3 1.27,-3.81; 4 3.81,-3.81; 5 3.81,3.81; 6 1.27,3.81; 7 -1.27,3.81; 8 -3.81,3.81
DIL08' = drill 0.813 pad 1.27: 1 -3.81,-3.81; 2 -1.27,-3.81; 3 1.27,-3.81; 4 3.81,-3.81; 5 3.81,3.81; 6 1.27,3.81; 7 -1.27,3.81; 8 -3.81,3.81
DIL16 = drill 0.813 long: 1 -8.89,-3.81; 2 -6.35,-3.81; 3 -3.81,-3.81; 4 -1.27,-3.81; 5 1.27,-3.81; 6 3.81,-3.81; 7 6.35,-3.81; 8 8.89,-3.81; 9 8.89,3.81; 10 6.35,3.81; 11 3.81,3.81; 12 1.27,3.81; 13 -1.27,3.81; 14 -3.81,3.81; 15 -6.35,3.81; 16 -8.89,3.81
2X03 = drill 0.95 pad 1.55 octagon: 1 -2.54,-1.27; 2 -2.54,1.27; 3 0,-1.27; 4 0,1.27; 5 2.54,-1.27; 6 2.54,1.27
AUDIO-JACK = drill 1.3 pad 2.184: RING 5,5; RSH 5,2.5; SLEEVE 0,0; TIP 5,-5; TSH 5,-2.5 | hole 1.2: 0,5; -2.5,5; -2.5,-5; 0,-5; 5,0
1X08 = drill 0.85 pad 1.422 long: 1 -8.89,0; 2 -6.35,0; 3 -3.81,0; 4 -1.27,0; 5 1.27,0; 6 3.81,0; 7 6.35,0; 8 8.89,0
1X06 = drill 0.85 pad 1.422 long: 1 -6.35,0; 2 -3.81,0; 3 -1.27,0; 4 1.27,0; 5 3.81,0; 6 6.35,0
1X10 = drill 0.85 pad 1.422 long: 1 -11.43,0; 2 -8.89,0; 3 -6.35,0; 4 -3.81,0; 5 -1.27,0; 6 1.27,0; 7 3.81,0; 8 6.35,0; 9 8.89,0; 10 11.43,0
22-23-2041 = drill 1 long: 1 -3.81,0; 2 -1.27,0; 3 1.27,0; 4 3.81,0
TCRT5000 = drill 0.8 octagon: A -2.54,-1.27; C 2.54,-1.27; E 2.54,1.27; K -2.54,1.27
RTRIMT93YA = drill 0.61: 1 0,-2.54; 2 0,0; 3 0,2.54
22-23-2031 = drill 1 long: 1 -2.54,0; 2 0,0; 3 2.54,0
0207/12 = drill 0.813 octagon: 1 -6.35,0; 2 6.35,0
DIP254P762X393-18 = drill 1.118 square: 1 -7.62,20.32 | drill 1.118: 2 -7.62,17.78; 3 -7.62,15.24; 4 -7.62,12.7; 5 -7.62,10.16; 6 -7.62,7.62; 7 -7.62,5.08; 8 -7.62,2.54; 9 -7.62,0; 10 0,0; 11 0,2.54; 12 0,5.08; 13 0,7.62; 14 0,10.16; 15 0,12.7; 16 0,15.24; 17 0,17.78; 18 0,20.32

### Placement (x,y rotation side)
C1  77.6,72.26 270 top
C2  77.6,64.77 270 top
C3  74.93,64.9 270 top
C4  74.93,72.39 90 top
C5  48.26,69.22 270 top
C6  71.12,100.33 270 top
C7  48.26,75.56 270 top
C8  66.04,97.16 90 top
C9  71.12,92.71 90 top
C10  77.6,116.08 270 top
C11  77.6,108.59 270 top
C12  74.93,108.71 270 top
C13  74.93,116.2 90 top
C14  48.26,113.03 270 top
C15  48.26,119.38 270 top
C16  66.04,140.97 90 top
C17  71.12,136.53 90 top
C18  71.12,144.14 270 top
C19  11.3,91.57 90 top
C20  11.3,99.06 90 top
C21  13.97,98.93 90 top
C22  13.97,91.44 270 top
C23  40.64,94.62 270 top
C24  40.64,88.27 270 top
C25  22.86,67.31 270 top
C26  17.78,71.12 270 top
C27  17.78,63.5 90 top
C28  11.3,136.02 90 top
C29  11.3,143.51 90 top
C30  13.97,143.38 90 top
C31  13.97,135.89 270 top
C32  43.18,139.06 270 top
C33  43.18,132.72 270 top
C34  24.13,111.12 270 top
C35  19.05,115.57 270 top
C36  19.05,107.95 90 top
C37  30.48,31.75 90 top
C38  30.48,45.09 90 top
D2  52.7,68.58 90 top
D4  52.7,112.4 90 top
D6  36.2,95.25 90 top
D8  37.47,139.7 90 top
G1  5.71,-24.13 0 top  (outside the outline)
G2  5.71,-34.92 0 top  (outside the outline)
IC1  75.56,83.82 180 top
IC2  OP275P  [DIL08']  63.5,83.82 180 top
IC3  OP275P  [DIL08']  51.44,83.82 180 top
IC4  75.56,127.64 180 top
IC5  OP275P  [DIL08']  63.5,127.64 180 top
IC6  OP275P  [DIL08']  51.44,127.64 180 top
IC7  13.34,80.01 0 top
IC8  OP275P  [DIL08']  25.4,80.01 0 top
IC9  OP275P  [DIL08']  37.47,80.01 0 top
IC10  13.34,124.46 0 top
IC11  OP275P  [DIL08']  25.4,124.46 0 top
IC12  OP275P  [DIL08']  37.47,124.46 0 top
IC13  43.18,31.75 0 top
IC14  43.18,45.09 0 top
ICSP  68.71,33.02 270 top
J1  81.28,96.52 180 top
J2  81.28,140.34 180 top
J3  7.62,67.31 0 top
J4  7.62,111.76 0 top
J5  58.42,55.88 180 top
J6  60.96,7.62 0 top
J7  40.64,7.62 0 top
JP1  34.04,55.88 180 top
NIR_F1  77.47,46.99 90 top
NIR_F2  77.47,35.56 90 top
NIR_F3  77.47,24.13 90 top
NIR_F4  77.47,12.7 90 top
NIR_M1  5.71,-78.74 0 top  (outside the outline)
NIR_M2  5.71,-90.17 0 top  (outside the outline)
NIR_M3  5.71,-101.6 0 top  (outside the outline)
NIR_M4  5.71,-113.03 0 top  (outside the outline)
OS1  6.98,-45.08 0 top  (outside the outline)
OS2  6.98,-53.34 0 top  (outside the outline)
OS3  6.98,-61.59 0 top  (outside the outline)
OS4  6.98,-69.85 0 top  (outside the outline)
POT1  5.08,-134.62 0 top  (outside the outline)
POT2  5.08,-123.83 0 top  (outside the outline)
POT3  5.08,-145.42 0 top  (outside the outline)
POT4  5.08,-156.21 0 top  (outside the outline)
POT5  5.08,-167 0 top  (outside the outline)
POT6  5.08,-177.8 0 top  (outside the outline)
POT7  5.08,-188.59 0 top  (outside the outline)
POT8  5.08,-199.39 0 top  (outside the outline)
POT_F1  8.26,55.88 0 top
POT_F2  8.26,43.18 0 top
POT_F3  8.26,30.48 0 top
POT_F4  8.26,17.78 0 top
POT_F5  17.14,48.26 0 top
POT_F6  17.14,36.83 0 top
POT_F7  17.14,24.13 0 top
POT_F8  17.14,11.43 0 top
POT_M1  4.45,-210.19 0 top  (outside the outline)
POT_M2  4.45,-221.62 0 top  (outside the outline)
POT_M3  4.45,-233.04 0 top  (outside the outline)
POT_M4  4.45,-244.47 0 top  (outside the outline)
POT_M5  4.45,-255.9 0 top  (outside the outline)
POT_M6  4.45,-267.33 0 top  (outside the outline)
POT_M7  4.45,-278.76 0 top  (outside the outline)
POT_M8  4.45,-290.19 0 top  (outside the outline)
R1  67.31,68.58 90 top
R2  72.39,68.58 270 top
R3  64.77,68.58 90 top
R4  69.85,68.58 270 top
R5  57.15,96.52 0 top
R6  50.16,96.52 90 top
R7  52.7,96.52 90 top
R8  68.58,96.52 90 top
R9  72.39,112.4 270 top
R10  63.5,96.52 270 top
R11  67.31,112.4 90 top
R12  62.23,68.58 270 top
R13  60.96,96.52 90 top
R14  47.62,96.52 90 top
R15  64.77,112.4 90 top
R16  69.85,112.4 270 top
R17  50.16,140.34 90 top
R18  52.7,140.34 90 top
R19  59.69,68.58 90 top
R20  62.23,112.4 270 top
R21  60.96,140.34 90 top
R22  68.58,140.34 90 top
R23  63.5,140.34 270 top
R24  47.62,140.34 90 top
R25  57.15,140.34 0 top
R26  59.69,112.4 90 top
R27  16.51,95.25 90 top
R28  21.59,95.25 270 top
R29  24.13,95.25 270 top
R30  19.05,95.25 90 top
R31  38.73,67.31 270 top
R32  36.2,67.31 270 top
R33  26.67,95.25 90 top
R34  27.94,67.31 270 top
R35  20.32,67.31 270 top
R36  25.4,67.31 90 top
R37  41.27,67.31 270 top
R38  31.75,67.31 180 top
R39  29.21,95.25 270 top
R40  16.51,139.7 90 top
R41  21.59,139.7 270 top
R42  24.13,139.7 270 top
R43  19.05,139.7 90 top
R44  40.01,111.76 270 top
R45  37.47,111.76 270 top
R46  26.67,139.7 90 top
R47  29.21,111.76 270 top
R48  21.59,111.76 270 top
R49  26.67,111.76 90 top
R50  42.55,111.76 270 top
R51  33.02,111.76 180 top
R52  29.21,139.7 270 top
R53  48.26,17.78 180 top
R54  48.26,20.32 180 top
R55  48.26,22.86 180 top
R56  30.48,15.24 0 top
R57  24.77,45.09 180 top
R58  7.62,-3.81 0 top  (outside the outline)
R59  7.62,-8.25 0 top  (outside the outline)
R60  48.26,15.24 180 top
R61  7.62,-12.7 0 top  (outside the outline)
R62  30.48,20.32 0 top
R63  30.35,17.78 0 top
R64  30.48,22.86 0 top
R65  7.62,-17.14 0 top  (outside the outline)
RG  80.01,68.58 270 top
RG1  80.01,112.4 270 top
RG2  8.89,95.25 90 top
RG3  8.89,139.7 90 top
U2  63.5,28.58 0 top

### Tracks (layer width: path | path; a pad name or v marks a point on that pad's centre or on a via)
0  (7 unrouted)
  Top 0.635: C26.2 C27.2 14.22,62.48 14.22,61.47 13.21,60.45 9.65,60.45 | 11.68,23.88 6.1,18.29 6.1,17.78 POT_F4.1 | 11.68,23.88 14.22,23.88 POT_F7.1 14.73,23.88 16.76,21.84 22.86,21.84 23.88,22.86 R64.1 24.38,22.86 30.48,28.96 C37.1 | 11.68,23.88 6.1,29.46 6.1,30.48 POT_F3.1 5.59,30.48 5.59,43.18 POT_F2.1 | R62.1 23.88,20.32 23.88,17.78 R63.1 24.38,17.78 24.38,15.24 R56.1 18.29,15.24 14.73,11.68 POT_F8.1 | C36.2 19.3,110.74 19.3,112.78 C35.2 | C31.2 14.22,133.6 16.26,133.6 R40.1 16.76,133.1 16.76,128.52 IC10.5 | C22.2 R27.1 16.76,88.9 16.76,83.82 IC7.5 | POT_F6.1 14.73,37.08 14.73,48.26 POT_F5.1 | J3.SLEEVE 7.62,65.53 9.65,63.5 9.65,60.45 | 9.65,60.45 9.65,59.94 5.59,55.88 POT_F1.1 | D8.A 37.59,145.8 37.59,143.76 43.18,138.18 C32.- C33.+ | C17.2 C18.2 71.12,142.75 75.69,147.32 76.71,147.32 79.25,144.78 79.25,142.75 81.28,140.72 J2.SLEEVE 81.28,138.18 79.25,136.14 79.25,133.6 80.77,132.08 80.77,130.56 75.69,125.48 73.66,125.48 72.14,123.95 IC4.5 72.14,123.44 72.14,118.87 R9.1 72.64,118.87 74.68,118.87 C13.2 75.18,118.36 78.74,114.81 78.74,99.06 | 36.58,101.6 36.58,97.54 40.64,93.47 C23.- C24.+ | D4.A 52.32,118.87 50.29,118.87 48.26,120.9 C15.+ | 36.58,101.6 38.1,101.6 41.15,104.65 41.15,105.66 47.24,111.76 C14.- | 36.58,101.6 D6.A | IC1.5 72.14,79.76 72.14,75.18 R2.1 72.64,75.18 74.68,75.18 C4.2 78.74,71.12 78.74,58.93 77.22,57.4 | C6.2 C9.2 | 77.22,57.4 77.72,57.4 79.25,55.88 | 77.22,57.4 75.69,57.4 | ICSP.6 73.66,30.48 76.2,33.02 78.74,33.02 80.77,35.05 80.77,54.36 79.76,55.37 | J7.6 J7.7 47.24,7.62 47.24,19.81 55.88,28.45 U2.9 U2.8 | 48.26,76.71 49.78,75.18 52.32,75.18 D2.A
  Top 0.635: IC13.9 53.34,35.56 53.85,36.07 55.88,36.07 U2.6 55.88,36.58 57.4,38.1 57.4,39.62 55.88,41.15 U2.4 55.88,41.66 57.4,43.18 57.4,44.7 55.88,46.23 U2.2
  Bottom 0.635: 25.91,47.24 24.89,47.24 R57.1 | 30.48,42.67 25.91,47.24 | IC13.14 39.37,36.58 37.21,38.73 | 30.48,39.75 31.62,38.61 37.08,38.61 37.21,38.73 | 37.21,38.73 38.1,39.62 38.1,42.67 39.12,43.69 39.12,48.77 IC14.14 | 25.91,47.24 29.97,51.31 29.97,55.88 JP1.7 30.48,55.88 28.45,57.91 25.91,57.91 C27.2 | R64.1 24.38,22.86 24.38,20.32 R62.1 | C35.2 18.8,113.28 18.8,114.43 17.14,116.08 17.14,117.47 15.62,119 12.32,119 12.07,118.75 | 17.27,128.02 IC10.5 13.97,125.09 6.98,125.09 6.35,124.46 6.35,120.02 7.62,118.75 12.07,118.75 | 12.07,118.75 10.67,117.35 10.67,116.84 7.62,113.79 J4.SLEEVE 7.62,109.73 10.16,107.19 10.16,106.05 6.98,102.87 6.98,95.63 13.72,88.9 C22.2 | POT_F5.1 10.67,48.26 | 10.67,48.26 6.1,52.83 6.1,55.88 POT_F1.1 | IC7.5 16.76,83.82 12.57,79.63 9.78,79.63 7.49,77.34 7.49,75.31 9.65,73.15 9.65,69.6 7.62,67.56 J3.SLEEVE | C14.- 52.32,115.82 52.32,118.36 D4.A 53.85,119.89 71.12,119.89 72.14,118.87 R9.1 | C15.+ 48.26,120.9 45.59,123.57 45.59,132.72 44.2,134.11 43.31,134.11 C33.+ | C9.2 71.12,93.34 74.93,89.53 79.63,89.53 81.41,87.76 81.41,86.23 78.99,83.82 75.69,83.82 72.14,80.26 IC1.5 | 49.28,69.09 52.32,72.14 52.32,74.68 D2.A | 49.28,69.09 48.26,68.07 | 53.34,48.77 52.32,48.77 | 53.34,48.77 55.88,46.23 U2.2 | 49.28,69.09 54.36,64.01 54.36,58.42 | 54.36,58.42 54.48,58.55 74.58,58.55 | 54.36,58.42 53.34,57.4 53.34,48.77 | U2.8 55.88,31.5 51.82,35.56 IC13.9 | R56.1 33.78,15.24 38.1,10.92 41.4,10.92 44.7,7.62 J7.6 | POT_F2.1 5.71,44.45 9.52,48.26 10.67,48.26
+5V  (5 unrouted)
  Top 0.635: NIR_F4.4 77.72,16.76 77.72,17.78 79.76,19.81 79.76,25.91 77.72,27.94 NIR_F3.4 | NIR_F2.4 79.76,41.66 79.76,48.77 77.72,50.8 NIR_F1.4 | 30.48,34.54 33.02,34.54 34.04,35.56 | POT_F6.3 19.3,37.08 23.37,41.15 23.88,41.15 30.48,34.54 | 30.48,34.54 C37.2 | IC14.16 34.04,48.77 33.02,47.75 30.48,47.75 26.42,47.75 25.4,48.77 22.86,48.77 | POT_F1.3 10.67,55.88 10.67,43.18 POT_F2.3 | 22.86,48.77 20.32,48.77 19.81,48.26 POT_F5.3 | 24.38,42.67 22.86,44.2 22.86,48.77 | 42.16,20.32 42.16,22.86 R55.2 | 42.16,11.68 42.16,15.24 R60.2 | 42.16,11.68 42.16,7.62 J7.5 | 42.16,20.32 42.16,17.78 R53.2 | 42.16,20.32 R54.2 | POT_F3.3 13.72,30.48 19.81,24.38 POT_F7.3 | 42.16,11.68 19.81,11.68 POT_F8.3
  Bottom 0.635: 70.1,35.56 74.17,39.62 77.22,39.62 NIR_F2.4 78.49,39.37 78.49,28.96 77.72,28.19 77.72,27.94 NIR_F3.4 | 70.1,35.56 72.26,33.4 72.26,29.97 70.61,28.32 63.75,28.32 U2.10 63.5,28.45 58.42,28.45 50.29,20.32 R54.2 | 70.1,35.56 ICSP.2 | R60.2 42.16,15.24 42.16,17.78 R53.2 | 13.21,17.78 13.72,17.78 19.81,23.88 POT_F7.3 | 13.21,17.78 POT_F4.3 | 13.21,17.78 13.21,10.16 14.22,9.14 17.78,9.14 19.3,10.67 19.3,11.18 POT_F8.3 | POT_F3.3 10.67,30.48 10.67,43.18 POT_F2.3 17.27,43.18 19.75,45.66 19.75,48.2 POT_F5.3
+9V  (1 unrouted)
  Top 0.635: R22.1 68.58,131.06 67.56,130.05 67.56,123.95 IC5.8 | C14.+ 42.67,119.89 42.67,120.9 36.58,127 35.05,127 34.04,128.02 IC12.8 | R35.1 20.32,82.8 21.34,83.82 IC8.8 21.84,83.82 23.37,82.3 29.46,82.3 30.99,83.82 IC9.8 34.04,83.82 36.58,81.28 53.85,81.28 54.86,80.26 IC3.8 55.37,80.26 56.39,81.28 56.39,87.38 60.45,91.44 64.01,91.44 65.02,90.42 68.58,90.42 R8.1 | IC2.8 67.56,80.26 70.1,80.26 71.12,81.28 75.69,81.28 76.71,80.26 IC1.7
  Bottom 0.635: IC11.8 19.68,130.18 13.84,130.18 12.19,128.52 IC10.7 | C32.+ 43.18,140.21 41.66,140.21 36.07,134.62 36.07,130.56 34.04,128.52 IC12.8 33.53,128.02 32.26,128.02 30.61,126.36 23.5,126.36 IC11.8 | IC7.7 12.19,83.82 14.35,85.98 19.18,85.98 21.34,83.82 IC8.8 | IC9.8 34.04,83.82 34.04,89.41 35.56,90.93 36.07,90.93 40.64,95.5 C23.+ 40.64,96.01 40.13,96.52 40.13,101.6 41.66,103.12 42.8,103.12 44.96,105.28 44.96,111 C14.+ 50.42,116.46 50.42,120.65 51.69,121.92 53.34,121.92 IC6.8 55.24,123.44 56.9,121.79 65.41,121.79 67.06,123.44 IC5.8 67.56,123.44 69.22,121.79 76.16,121.79 76.84,122.47 IC4.7 | 79.25,57.91 79.25,60.96 78.74,61.47 78.74,78.23 77.22,79.76 IC1.7 | C5.+ 48.26,70.61 50.42,72.77 50.42,75.31 54.86,79.76 IC3.8 55.37,79.76 57.66,77.47 66.04,77.47 67.31,78.74 IC2.8 | R48.1 19.68,120.02 19.68,126.36 IC11.8
-9V  (1 unrouted)
  Top 0.635: IC11.4 27.94,121.92 20.83,121.92 19.81,120.9 17.27,120.9 IC10.4 | IC6.4 47.24,131.57 43.18,131.57 C33.- | 46.23,87.38 40.64,87.38 C24.- | 46.23,87.38 47.24,87.38 IC3.4 | 75.18,55.88 73.66,55.88 69.79,59.75 66.74,59.75 65.53,60.96 58.93,60.96 49.78,70.1 49.78,72.64 48.26,74.17 C7.- 48.26,74.68 46.74,76.2 IC9.4 41.15,76.2 39.62,77.72 33.53,77.72 32,76.2 IC8.4 | C15.- 48.26,116.33 49.78,114.81 49.78,106.68 46.23,103.12 46.23,87.38
  Bottom 0.635: 63.5,133.6 R23.2 63.5,135.25 62.86,135.89 59.05,135.89 59.05,135.76 55.88,132.59 | IC4.4 71.75,129.79 70.1,128.14 61.59,128.14 59.69,130.05 IC5.4 59.44,131.57 56.9,131.57 55.88,132.59 | IC11.4 R49.2 | 43.18,120.4 44.96,120.4 47.24,118.11 C15.- 46.35,116.2 33.66,116.2 IC11.4 | 43.18,120.4 41.66,120.4 IC12.4 | 43.18,120.4 C33.- | 29.46,120.4 IC11.4 | 55.88,132.59 48.77,132.59 IC6.4 | IC1.4 71.63,87.38 69.34,85.09 65.28,85.09 63.5,86.87 R10.2 63.5,91.44 62.86,92.08 59.05,92.08 55.88,88.9 | R36.2 26.42,74.68 26.92,74.68 28.45,76.2 29.08,76.2 | IC8.4 29.08,76.2 | IC7.4 18.54,76.2 20.7,78.36 26.92,78.36 29.08,76.2 | C24.- 40.64,84.84 40.13,84.33 40.13,77.22 41.15,76.2 IC9.4 | 55.88,88.9 56.9,87.88 59.44,87.88 IC2.4 | 55.88,88.9 48.77,88.9 47.75,87.88 IC3.4
ARDUINO1
  Top 0.305: U2.1 55.88,49.78 61.98,55.88 J5.3
ARDUINO2
  Bottom 0.305: U2.3 56.77,43.81 57.4,44.45 57.4,55.88 J5.5
ARDUINO3
  Top 0.305: J5.6 54.36,55.88 54.36,40.64 55.88,39.12 U2.5
ARDUINO4
  Bottom 0.305: JP1.2 43.18,55.88 43.18,54.86 48.26,49.78 48.26,44.7 50.8,42.16 50.8,39.12 55.88,34.04 U2.7
CLK
  Bottom 0.305: 42.16,35.56 42.16,39.12 43.18,40.13 43.18,47.75 42.16,48.77 IC14.13 | 42.16,35.56 42.16,34.54 45.72,30.99 51.31,30.99 54.86,27.43 56.39,27.43 58.93,29.97 64.01,29.97 67.06,33.02 ICSP.3 | 42.16,35.56 IC13.13
CS1
  Top 0.305: JP1.3 40.39,55.5 43.31,52.58 45.97,52.58 49.28,49.28 IC14.10
CS2
  Top 0.305: IC13.10 49.28,35.56 45.21,39.62 43.69,39.62 43.18,40.13 43.18,50.8 41.27,52.7 39.37,52.7 38.1,53.98 38.1,55.88 JP1.4
DIN
  Bottom 0.305: 47.24,35.56 47.24,39.12 48.26,40.13 48.26,43.69 47.24,44.7 47.24,48.77 IC14.11 | 47.24,35.56 50.8,32 51.31,32 53.34,29.97 56.39,29.97 61.47,35.05 64.01,35.05 66.04,37.08 67.56,37.08 68.58,36.07 68.58,35.05 69.6,34.04 69.6,33.02 ICSP.4 | 47.24,35.56 IC13.11
DOUT
  Top 0.305: ICSP.1 67.06,35.56 67.06,37.08 64.01,40.13 61.47,40.13 56.39,35.05 53.85,35.05 52.32,33.53 51.31,33.53 50.8,34.04 50.29,34.04 49.78,33.53 46.74,33.53 44.7,35.56 IC13.12
  Bottom 0.305: IC13.12 44.7,35.56 44.7,39.12 45.72,40.13 45.72,47.75 44.7,48.77 IC14.12
EMG1  (2 unrouted)
EMG2  (2 unrouted)
EMG3  (2 unrouted)
EMG4  (2 unrouted)
N$1
  Top 0.305: RG.2 80.26,62.48 80.26,73.66 81.28,74.68 81.28,85.85 79.76,87.38 IC1.1
N$2
  Top 0.305: RG.1 79.76,75.18 79.76,79.76 IC1.8
N$3  (1 unrouted)
  Top 0.305: 76.71,91.44 76.71,87.88 IC1.2
N$4
  Top 0.305: C8.2 66.04,98.55 72.14,92.46 72.14,89.41 71.63,88.9 71.12,88.9 63.5,81.28 63.5,79.76 62.48,78.74 62.48,75.18 R12.1
  Bottom 0.305: R13.2 60.96,102.36 63.25,100.08 66.04,100.08 C8.2
N$5
  Top 0.305: R1.1 73.66,68.58 76.2,68.58 | 76.2,68.58 77.22,69.6 C1.2 | 76.2,68.58 77.22,67.56 C2.1
N$6
  Top 0.305: C1.1 77.22,75.18 77.22,77.22 74.68,79.76 IC1.6
N$7
  Top 0.305: R19.2 59.94,75.18 59.94,79.76 IC2.5
  Bottom 0.305: R19.2 62.23,72.39 66.29,72.39 76.2,62.48 77.22,62.48 C2.2
N$8
  Top 0.305: 65.02,75.18 67.06,75.18 R1.2 | 65.02,75.18 65.02,79.76 IC2.7 | 65.02,75.18 R3.2
  Bottom 0.305: IC2.6 62.48,80.26 64.52,80.26 IC2.7
N$9
  Top 0.305: R4.2 71.12,63.5 72.64,63.5 73.66,62.48 74.68,62.48 C3.2
  Bottom 0.305: R3.1 64.77,60.96 65.41,60.33 68.58,60.33 69.85,61.59 R4.2
N$10
  Top 0.305: R4.1 C4.1
  Bottom 0.305: IC3.5 47.75,80.26 48.13,80.26 49.78,81.92 68.2,81.92 69.6,80.52 69.6,75.18 R4.1
N$11
  Top 0.305: 61.98,63.5 61.98,70.61 52.83,79.76 IC3.7 52.32,80.26 50.29,80.26 IC3.6 | 61.98,63.5 61.98,62.48 R12.2 | 61.98,63.5 65.02,63.5 66.04,62.48 66.04,61.98 67.06,60.96 67.56,60.96 68.58,61.98 68.58,62.48 73.15,67.06 74.68,67.06 C3.1
N$12
  Bottom 0.305: NIR_F1.2 66.55,45.72 63.5,48.77 U2.18
N$13  (1 unrouted)
N$14
  Top 0.305: R13.1 60.96,88.9 IC2.3 63.5,88.9 69.09,88.9 70.1,89.92 71.12,89.92 C9.1
N$15
  Top 0.305: R5.3 59.94,99.06 63.5,102.62 R10.1
N$16
  Top 0.305: R5.2 58.93,96.52 66.55,104.14 69.09,104.14 70.1,103.12 71.12,103.12 C6.1
  Bottom 0.305: R5.2 53.85,96.52 47.75,102.62 R14.2
N$17
  Top 0.305: IC3.2 52.32,87.88 50.29,89.92 R6.1 50.29,90.42 52.32,92.46 52.32,102.62 R7.2
N$18
  Bottom 0.305: R19.1 62.23,64.77 71.12,64.77 72.39,63.5 R2.2
N$19
  Top 0.305: IC2.2 65.02,87.88 67.06,87.88 IC2.1
  Bottom 0.305: R6.2 50.29,102.62 51.31,102.62 56.39,97.54 63.5,97.54 66.04,95 C8.1 66.04,94.49 65.02,93.47 65.02,87.88 IC2.2
N$20
  Top 0.305: R5.1 58.93,93.98 67.56,102.62 68.58,102.62 R8.2
N$21
  Bottom 0.305: IC4.1 81.28,129.54 81.28,118.36 80.26,117.35 80.26,106.17 RG1.2
N$22
  Top 0.305: RG1.1 79.76,118.87 79.76,123.44 IC4.8
N$23
  Top 0.305: IC4.6 77.22,120.9 77.22,118.87 C10.1
N$24
  Top 0.305: R11.1 67.56,106.17 68.58,106.17 72.64,110.24 76.71,110.24 C11.1 77.72,111.25 77.72,113.28 C10.2
N$25
  Top 0.305: R14.1 47.75,89.92 49.78,87.88 IC3.3
N$26  (1 unrouted)
  Top 0.305: 76.2,99.06 74.17,97.03 74.17,87.88 IC1.3
N$27
  Top 0.305: R26.2 59.94,118.87 59.94,123.44 IC5.5
  Bottom 0.305: C11.2 77.22,106.17 66.04,117.35 60.96,117.35 59.94,118.36 R26.2
N$28
  Top 0.305: 65.02,118.87 67.06,118.87 R11.2 | 65.02,118.87 65.02,123.44 IC5.7 | 65.02,118.87 R15.2
  Bottom 0.305: IC5.6 62.48,123.95 64.52,123.95 IC5.7
N$29
  Bottom 0.305: R15.1 64.77,106.81 65.79,107.82 67.94,107.82 69.6,106.17 R16.2 70.1,105.66 71.12,104.65 73.15,104.65 74.68,106.17 C12.2
N$30
  Top 0.305: C13.1 74.68,113.79 70.1,118.36 R16.1 69.6,118.36 68.58,117.35 59.44,117.35 53.85,122.94 53.85,124.46 53.34,124.97 49.78,124.97 48.77,123.95 47.75,123.95 IC6.5
N$31
  Top 0.305: IC6.6 50.29,123.95 52.32,123.95 IC6.7 52.83,123.44 52.83,122.94 66.55,109.22 | 66.55,109.22 68.58,111.25 C12.1 | 66.55,109.22 63.5,106.17 62.48,106.17 R20.2
N$32
  Top 0.305: IC6.2 52.32,131.57 50.29,133.6 R17.1 52.32,136.14 52.32,146.3 R18.2
N$33  (2 unrouted)
N$34
  Top 0.305: R20.1 62.48,118.87 62.48,122.43 63.5,123.44 63.5,132.59 65.02,134.11 65.02,142.24 66.04,143.26 C16.2
  Bottom 0.305: C16.2 66.04,143.76 62.86,143.76 60.96,145.67 R21.2
N$35
  Top 0.305: R21.1 60.96,132.59 61.98,131.57 IC5.3
  Bottom 0.305: C17.1 71.12,133.22 69.28,131.38 69.28,130.11 68.58,129.41 62.99,129.41 62.23,130.18 IC5.3
N$36
  Top 0.305: IC4.2 76.71,131.57 76.71,135.13 J2.RING
N$37
  Top 0.305: 66.04,131.57 67.06,131.57 IC5.1 | 66.04,131.57 65.02,131.57 IC5.2 | C16.1 66.04,131.57
  Bottom 0.305: C16.1 66.04,138.68 51.31,138.68 46.23,143.76 46.23,148.46 46.99,149.23 48.89,149.23 50.16,147.95 R17.2
N$38  (1 unrouted)
  Top 0.305: 76.2,143.26 74.17,141.22 74.17,131.57 IC4.3
N$39
  Top 0.305: R25.3 57.4,143.26 60.45,143.26 63.5,146.3 R23.1
N$40
  Top 0.305: R25.1 57.4,138.18 58.93,138.18 67.06,146.3 68.58,146.3 R22.2
N$41
  Top 0.305: R24.1 47.75,133.6 49.78,131.57 IC6.3
N$42
  Bottom 0.305: R24.2 47.75,146.3 53.34,140.72 56.9,140.72 R25.2 57.4,140.72 65.53,140.72 71.12,146.3 C18.1
N$43
  Top 0.305: R26.1 59.94,105.66 60.96,105.66 61.98,104.65 71.12,104.65 72.14,105.66 R9.2
N$44
  Top 0.305: RG2.2 8.64,101.6 8.64,90.42 7.62,89.41 7.62,77.72 9.14,76.2 IC7.1
N$45
  Top 0.305: RG2.1 9.14,88.9 9.14,83.82 IC7.8
N$46
  Top 0.305: C19.1 11.68,88.9 11.68,86.36 14.22,83.82 IC7.6
N$47
  Top 0.305: 11.68,96.52 11.68,94.49 C19.2 | 11.68,96.52 12.7,97.54 17.27,97.54 21.34,101.6 R28.1 | 11.68,96.52 C20.1
N$48
  Top 0.305: IC8.5 29.46,83.82 29.46,88.9 R39.2
  Bottom 0.305: C20.2 11.68,101.6 20.83,92.46 25.4,92.46 28.96,88.9 R39.2
N$49
  Top 0.305: IC8.6 24.38,83.82 | R28.2 R29.2 24.38,88.9 24.38,83.82 | 24.38,83.82 IC8.7
N$50
  Top 0.305: C21.2 14.22,101.6 15.24,102.62 17.78,102.62 18.8,101.6 R30.2 19.3,101.6 20.32,102.62 22.86,102.62 23.88,101.6 R29.1
N$51
  Top 0.305: C22.1 13.72,93.98 18.8,88.9 R30.1 19.3,88.9 20.32,89.92 29.97,89.92 33.02,86.87 37.08,86.87 40.13,83.82 IC9.5
N$52
  Top 0.305: IC9.6 IC9.7 | C21.1 14.22,96.52 21.34,96.52 26.42,101.6 R33.2
  Bottom 0.305: IC9.7 35.05,83.82 34.04,82.8 33.02,82.8 31.75,84.07 31.75,96.77 26.92,101.6 R33.2
N$53
  Top 0.305: R32.2 36.58,60.96 36.58,71.63 38.61,73.66 R31.1 39.12,73.66 36.58,76.2 IC9.2
N$54  (2 unrouted)
N$55
  Bottom 0.305: R34.2 24.38,64.52 22.86,64.52 C25.2 22.86,65.02 21.21,66.67 21.21,70.61 21.72,71.12 29.46,71.12 31.75,73.41 31.75,83.06 26.92,87.88 26.92,88.9 R33.1
N$56
  Top 0.305: R34.1 27.94,75.18 26.92,76.2 IC8.3
  Bottom 0.305: IC8.3 26.42,76.2 24.96,74.74 23.69,74.74 20.7,71.75 18.41,71.75 17.78,72.39 C26.1
N$57
  Top 0.305: IC7.2 12.19,76.2 12.19,72.64 J3.RING
N$58
  Top 0.305: IC8.2 22.86,76.2 | 22.86,76.2 IC8.1 | C25.1 22.86,76.2
  Bottom 0.305: R31.2 37.59,60.96 32.51,66.04 26.42,66.04 22.86,69.6 C25.1
N$59  (1 unrouted)
  Top 0.305: 12.7,64.52 14.73,66.55 14.73,76.2 IC7.3
N$60
  Top 0.305: R36.1 28.96,64.52 31.5,64.52 R38.3
N$61
  Top 0.305: R35.2 20.83,60.96 29.46,69.6 31.5,69.6 R38.1
N$62
  Top 0.305: R37.1 41.15,73.66 38.61,76.2 IC9.3
N$63
  Top 0.305: C27.1 18.8,60.96 19.81,59.94 22.86,59.94 29.97,67.06 31.5,67.06 R38.2
  Bottom 0.305: R38.2 32,67.06 35.05,67.06 41.15,60.96 R37.2
N$64
  Bottom 0.305: R27.2 16.76,101.6 17.78,102.62 27.94,102.62 28.96,101.6 R39.1
N$65
  Top 0.305: RG3.2 8.64,145.8 8.64,134.62 7.62,133.6 7.62,122.43 9.14,120.9 IC10.1
N$66
  Top 0.305: RG3.1 9.14,133.1 9.14,128.52 IC10.8
N$67
  Top 0.305: C28.1 11.68,133.1 11.68,131.06 14.22,128.52 IC10.6
N$68
  Top 0.305: 11.18,139.7 11.18,140.72 C29.1 | 11.18,139.7 11.18,138.68 C28.2 | R41.1 15.24,139.7 11.18,139.7
N$69
  Bottom 0.305: C29.2 11.3,145.92 21.97,135.25 27.3,135.25 R52.2 29.46,133.1 29.46,128.52 IC11.5
N$70
  Top 0.305: 24.38,128.52 26.42,128.52 IC11.6 | R41.2 21.84,133.6 23.88,133.6 R42.2 24.38,133.1 24.38,128.52 | 24.38,128.52 IC11.7
N$71
  Top 0.305: R43.2 17.78,144.78 16.26,144.78 15.24,145.8 14.22,145.8 C30.2
  Bottom 0.305: R42.1 22.23,147.95 20.95,147.95 R43.2
N$72
  Top 0.305: C31.1 R43.1 20.32,134.62 26.92,134.62 27.94,133.6 27.94,133.1 29.97,131.06 37.59,131.06 40.13,128.52 41.15,128.52 IC12.5
N$73
  Top 0.305: IC12.7 36.58,128.52 38.61,128.52 IC12.6 39.12,128.02 40.13,128.02 41.15,127 41.66,127 42.67,128.02 42.67,130.05 38.61,134.11 38.61,134.62 26.92,146.3 R46.2 25.4,147.32 21.34,147.32 20.32,146.3 20.32,145.8 15.75,141.22 14.22,141.22 C30.1
N$74
  Top 0.305: IC12.2 36.58,120.4 37.59,120.4 39.62,118.36 R44.1 39.62,117.86 37.59,115.82 37.59,105.66 R45.2
N$75  (2 unrouted)
N$76
  Top 0.305: R46.1 26.92,133.1 26.92,132.08 30.48,128.52 30.48,114.81 24.38,108.71 C34.2
  Bottom 0.305: R47.2 28.96,105.66 27.94,105.66 25.4,108.2 24.38,108.2 C34.2
N$77
  Top 0.305: IC11.3 R47.1
  Bottom 0.305: C35.1 19.05,117.47 20.32,116.2 22.23,116.2 IC11.3
N$78
  Top 0.305: IC10.2 12.19,120.4 12.19,116.84 J4.RING
N$79
  Top 0.305: IC11.1 21.84,120.9 23.88,120.9 IC11.2 24.38,120.4 24.38,113.79 C34.1
  Bottom 0.305: R44.2 39.62,105.66 39.62,106.68 33.02,113.28 24.38,113.28 C34.1
N$80  (1 unrouted)
  Top 0.305: 12.7,109.22 14.73,111.25 14.73,120.4 IC10.3
N$81
  Top 0.305: R51.3 30.48,109.22 R49.1
N$82
  Top 0.305: R51.1 31.5,114.3 22.86,105.66 21.84,105.66 R48.2
N$83
  Top 0.305: R50.1 42.16,118.36 41.15,118.36 39.12,120.4 IC12.3
N$84
  Bottom 0.305: R50.2 42.16,105.16 40.51,103.5 37.47,103.5 35.56,105.41 35.56,109.22 R51.2 25.4,111.76 C36.1
N$85
  Bottom 0.305: R40.2 18.41,144.14 27.3,144.14 R52.1
N$86
  Top 0.305: NIR_F2.2 77.22,34.54 72.64,34.54 63.5,43.69 U2.16
N$87
  Top 0.305: NIR_F3.2 73.15,22.86 65.02,30.99 65.02,37.08 63.5,38.61 U2.14
N$88
  Top 0.305: NIR_F4.2 77.22,11.68 75.69,11.68 70.61,16.76 53.85,16.76 53.34,17.27 53.34,23.37 63.5,33.53 U2.12
N$89
  Top 0.305: IC13.1 34.04,27.94 29.97,32 15.75,32 7.11,40.64 7.11,54.86 8.13,55.88 POT_F1.2
N$90
  Top 0.305: IC13.2 36.58,27.94 32,32.51 16.26,32.51 8.64,40.13 8.64,43.18 POT_F2.2
N$91
  Bottom 0.305: IC13.3 39.37,28.96 37.85,30.48 16.38,30.48 13.08,27.18 9.65,27.18 8.26,28.58 POT_F3.2
N$92
  Top 0.305: IC13.4 41.66,27.94 37.59,23.88 26.92,23.88 24.38,21.34 23.37,21.34 21.84,19.81 10.16,19.81 8.13,17.78 POT_F4.2
N$93
  Top 0.305: IC13.5 44.2,27.94 39.12,33.02 20.83,33.02 18.29,35.56 18.29,47.24 17.27,48.26 POT_F5.2
N$94
  Bottom 0.305: IC13.6 46.74,27.94 41.66,33.02 20.83,33.02 17.27,36.58 POT_F6.2
N$95
  Bottom 0.305: IC13.7 49.28,27.94 47.24,25.91 22.86,25.91 22.35,26.42 19.3,26.42 17.27,24.38 POT_F7.2
N$96
  Bottom 0.305: IC13.8 51.82,27.94 45.21,21.34 32.77,21.34 27.69,16.26 21.84,16.26 17.27,11.68 POT_F8.2
N$97
  Top 0.305: R57.2 24.89,45.21 34.04,45.21 36.58,47.75 36.58,48.77 IC14.15
N$98  (via drill 0.35)
  Top 0.305: v74.68,38.61 74.68,40.64 77.22,43.18 NIR_F1.1
  Bottom 0.305: R55.1 66.8,22.86 74.68,30.73 v74.68,38.61
N$99
  Bottom 0.305: R54.1 69.22,20.32 77.47,28.58 NIR_F2.1
N$100
  Top 0.305: R53.1 74.68,17.78 77.22,20.32 NIR_F3.1
N$101
  Top 0.305: R60.1 71.12,15.24 NIR_F4.1
N$103  (1 unrouted)
N$104  (1 unrouted)
N$106  (1 unrouted)
N$107  (2 unrouted)
N$108  (1 unrouted)
N$109  (1 unrouted)
N$110  (1 unrouted)
N$111  (1 unrouted)
N$112  (1 unrouted)
N$113  (1 unrouted)
N$114  (1 unrouted)
N$115  (1 unrouted)
N$116  (1 unrouted)
N$117  (1 unrouted)
N$118  (1 unrouted)
N$119  (1 unrouted)
N$120  (1 unrouted)
N$121  (1 unrouted)
N$122  (1 unrouted)
N$123  (1 unrouted)
N$124  (1 unrouted)
N$125  (1 unrouted)
N$126  (1 unrouted)
N$127  (1 unrouted)
N$128  (1 unrouted)
N$129  (1 unrouted)
N$130  (1 unrouted)
N$131  (1 unrouted)
N$132  (1 unrouted)
N$133  (1 unrouted)
N$134  (1 unrouted)
N$135  (1 unrouted)
N$136  (1 unrouted)
N$137  (1 unrouted)
N$138  (1 unrouted)
N$139  (1 unrouted)
N$140  (1 unrouted)
N$141  (1 unrouted)
N$142  (1 unrouted)
N$143  (3 unrouted)
NIR1  (via drill 0.35)  (2 unrouted)
  Top 0.305: R64.2 39.12,22.86 42.16,25.91 44.7,25.91 45.72,26.92 v45.72,32 | 44.7,41.66 50.8,47.75 50.8,57.15 53.34,59.69 64.13,59.69 64.77,59.05 67.94,59.05 69.22,57.79 69.22,56.26 77.22,48.26 NIR_F1.3
  Bottom 0.305: v45.72,32 43.18,34.54 43.18,39.12 44.2,40.13 44.2,41.15
NIR2  (via drill 0.35)  (2 unrouted)
  Top 0.305: v48.26,32 48.26,26.92 46.74,25.4 42.67,25.4 40.64,23.37 40.64,22.35 37.08,18.8 37.08,17.78 R63.2 | 47.24,41.66 53.34,47.75 53.34,56.9 54.99,58.55 61.85,58.55 63.5,56.9 63.5,54.86 65.02,53.34 65.02,47.24 75.18,37.08 77.22,37.08 NIR_F2.3
  Bottom 0.305: v48.26,32 45.72,34.54 45.72,39.12 46.74,40.13 46.74,41.15
NIR3  (via drill 0.35)  (1 unrouted)
  Top 0.305: v50.8,33.02 50.8,24.89 42.67,16.76 36.07,16.76 35.56,17.27 35.56,19.3 36.58,20.32 R62.2
  Bottom 0.305: R62.2 40.13,20.32 41.15,19.3 71.12,19.3 77.22,25.4 NIR_F3.3 | 49.78,41.15 49.78,37.59 50.8,36.58 v50.8,33.02
NIR4  (1 unrouted)
  Bottom 0.305: R56.2 38.86,15.24 40.51,13.59 77.09,13.59 NIR_F4.3 80.77,17.27 80.77,39.88 79.38,41.28 72.26,41.28 71.12,40.13 55.37,40.13 54.36,41.15 52.32,41.15